# Altium project mb1260.PrjPCB (part 2 of 3)

## Sheet ARDUINO.SchDoc: Arduino UNO connectors
size A4; Author: N.P; CompanyName: STMicroelectronics; Organization: MCD/APPLIS/LMS; DocumentNumber: 12; Revision: D-01; SheetNumber: 12; SheetTotal: 13; Project: STM32F723e-DISCO; BOM Version: D-01
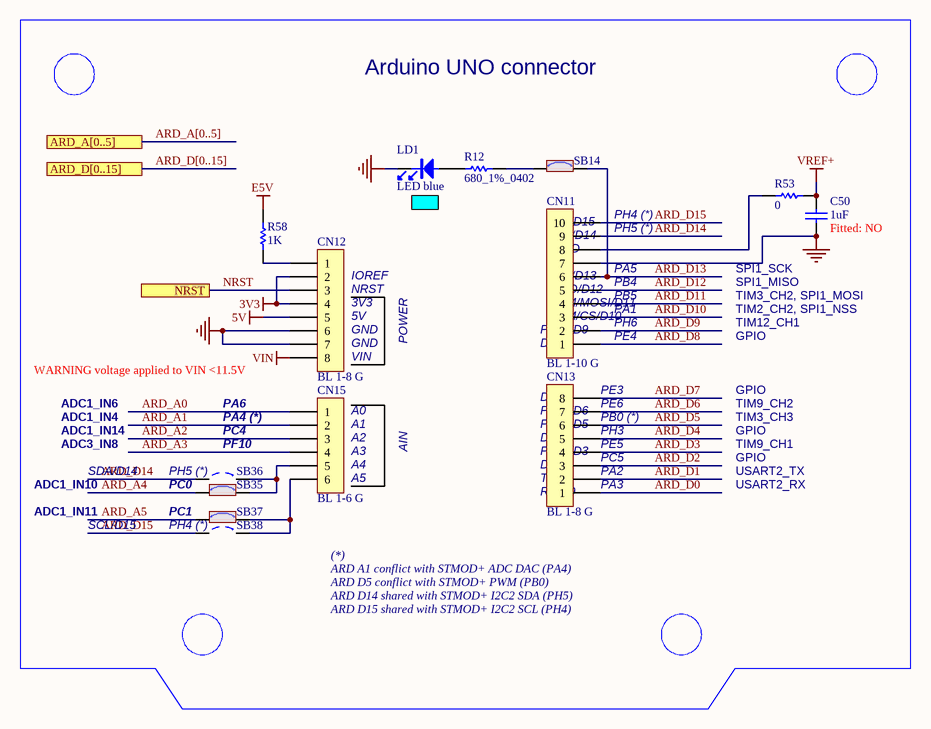
[diagram p5: ARDUINO.SchDoc]

### Parts
C50  1uF  Fitted: NO  [0603C]
CN11  BL 1-10 G  [HDR_1X10_2R54_W]
CN12  BL 1-8 G  [HDR_1X8_2R54_W]
CN13  BL 1-8 G  [HDR_1X8_2R54_W]
CN15  BL 1-6 G  [HDR_1X6_2R54_W]
LD1  LED blue  [0603D]
R12  680_1%_0402  [0402R]
R53  0  [0402R]
R58  1K  [0402R]
SB14  Solder Bridge ON  [JP2_SMD]  (value not drawn)
SB35  Solder Bridge ON  [JP2_SMD]  (value not drawn)
SB36  Solder Bridge OFF  [JP2_SMD]  (value not drawn)
SB37  Solder Bridge ON  [JP2_SMD]  (value not drawn)
SB38  Solder Bridge OFF  [JP2_SMD]  (value not drawn)

### Ports
ARD_A[0..5], ARD_D[0..15], NRST

### Nets
3V3: CN12.2 CN12.4
5V: CN12.5
E5V: R58.2
GND: C50.1 CN11.7 CN12.6 CN12.7 LD1.2
VIN: CN12.8
VREF+: C50.2 R53.2
ARD_A0: CN15.1
ARD_A1: CN15.2
ARD_A2: CN15.3
ARD_A3: CN15.4
ARD_A4: SB35.1
ARD_A5: SB37.1
ARD_D0: CN13.1
ARD_D1: CN13.2
ARD_D2: CN13.3
ARD_D3: CN13.4
ARD_D4: CN13.5
ARD_D5: CN13.6
ARD_D6: CN13.7
ARD_D7: CN13.8
ARD_D8: CN11.1
ARD_D9: CN11.2
ARD_D10: CN11.3
ARD_D11: CN11.4
ARD_D12: CN11.5
ARD_D13: CN11.6 SB14.2
ARD_D14: CN11.9 SB36.1
ARD_D15: CN11.10 SB38.1
NRST: CN12.3 ; port NRST
NetCN11_8: CN11.8 R53.1
NetCN12_1: CN12.1 R58.1
NetCN15_5: CN15.5 SB35.2 SB36.2
NetCN15_6: CN15.6 SB37.2 SB38.2
NetLD1_1: LD1.1 R12.1
NetR12_2: R12.2 SB14.1

### Buses and harness runs
bus ARD_A[0..5] = port ARD_A[0..5]
bus ARD_D[0..15] = port ARD_D[0..15]

### Notes on the sheet
- Arduino UNO connector
- PH4 (*)
- (near CN12) IOREF
- (near CN12) NRST
- (near CN11) SDA/D14
- (near CN11) SCL/D15
- (near CN11) SCK/D13
- (near CN11) MISO/D12
- (near CN11) AVDD
- (near CN11) GND
- (near CN11) PB4
- (near CN11) PA5
- (near CN11) PH5 (*)
- SPI1_MISO
- SPI1_SCK
- (near CN12) 3V3
- (near CN12) 5V
- (near CN12) GND
- POWER
- (near CN11) D8
- (near CN11) PWM/D9
- (near CN11) PWM/CS/D10
- (near CN11) PWM/MOSI/D11
- (near CN11) PA1
- (near CN11) PE4
- (near CN11) PH6
- (near CN11) PB5
- TIM12_CH1
- TIM2_CH2, SPI1_NSS
- TIM3_CH2, SPI1_MOSI
- GPIO
- WARNING voltage applied to VIN <11.5V
- ADC1_IN4
- ADC1_IN6
- PA6
- PA4 (*)
- (near CN15) A0
- (near CN15) A1
- (near CN12) VIN
- (near CN13) PWM/D5
- (near CN13) PWM/D6
- (near CN13) D7
- (near CN13) PE6
- (near CN13) PE3
- (near CN13) PB0 (*)
- TIM3_CH3
- TIM9_CH2
- ADC1_IN10
- ADC3_IN8
- ADC1_IN14
- SDA/D14
- (near SB36) PH5 (*)
- PC0
- PC4
- PF10
- (near CN15) A2
- (near CN15) A3
- (near CN15) A4
- (near CN15) A5
- AIN
- (near CN13) TX/D1
- (near CN13) D2
- (near CN13) D4
- (near CN13) PWM/D3
- (near CN13) PA2
- (near CN13) PC5
- (near CN13) PE5
- (near CN13) PH3
- (near CN13) PA3
- USART2_RX
- USART2_TX
- TIM9_CH1
- ADC1_IN11
- SCL/D15
- PC1
- (near CN13) RX/D0
- (*)
  ARD A1 conflict with STMOD+ ADC DAC (PA4)
  ARD D5 conflict with STMOD+ PWM (PB0)
  ARD D14 shared with STMOD+ I2C2 SDA (PH5)
  ARD D15 shared with STMOD+ I2C2 SCL (PH4)
- Title:
- Project:
- Size:
- Revision:
- Variant:
- -
- Date:
- Reference:
- Sheet:
- of

### Library data of the parts
C50 = Cap_1uF_X5R_10%_0603: Capacitor,1uF,16V,X5R,10%,0603,YAGEO; Manuf_Part_1: CC0603KRX5R7BB105; Ordered by: Subcon; Revision: July-2002: Re-released for DXP Platform.; Value: 1uF; Order: CC0603KRX5R7BB105; Manuf_1: YAGEO; ECCN_US/EU: n/a
CN11 = Header 10X1_Female_THT: Header, 10-Pin, Single row, female, THT, 2.54; Manuf_1: Fischer Electronik; Ordered by: Subcon; Fitted: YES; Manuf_Part_1: BL 1-10 G; Distrib: Sub Co; ECCN_US/EU: n/a
CN12 CN13 = Header 8X1_Female_THT: Header, 8-Pins, Single row, female, THT, 2.54; Manuf_1: Fischer Electronik; Ordered by: Subcon; Fitted: YES; Manuf_Part_1: BL 1-8 G; Distrib: Sub Co; ECCN_US/EU: n/a
CN15 = Header 6X1_Female_THT: Header, 6-Pins, Single row, female THT, 2.54; Manuf_1: Fischer Electronik; Ordered by: Subcon; Fitted: YES; Manuf_Part_1: BL 1-6 G; Distrib: Sub Co; ECCN_US/EU: n/a
LD1 = LED_blue: LED blue 0603; Manuf_1: everlight; Manuf_Part_1: 19-213SUBC/S400-A5/S208-2/S4/TR8; ECCN_US/EU: EAR99/NEC; Fitted: YES; Ordered by: Subcon
R12 = Res_680_1%_0402: Resistor,680,0402,1%,YAGEO; Manuf_Part_1: RC0402FR-07680RL; Manuf_Part_2: RT0402FRE07680RL; Ordered by: Subcon; Fitted: YES; Value: 680; ECCN_US/EU: n/a; Manuf_1: YAGEO; Distrib: FARNELL; Manuf_2: YAGEO
R53 = Res_0_5%_0402: as R35 on sheet AUDIO; Value: 0; ECCN_US/EU: n/a; Manuf_1: YAGEO; Distrib: FARNELL
R58 = Res_1K_1%_0402: Resistor,1K,0402,1%,YAGEO; Manuf_Part_1: RC0402FR-071KL; Ordered by: Subcon; Fitted: YES; Value: 1K; Manuf_1: YAGEO; Order: RC0402FR-071KL; ECCN_US/EU: n/a
SB14 SB35 SB37 = SB_ON: Fitted: YES; Ordered by: Subcon; Revision: July-2002: Re-released for DXP Platform.; ECCN_US/EU: n/a
SB36 SB38 = SB_OFF: Fitted: NO; Ordered by: Subcon; Revision: July-2002: Re-released for DXP Platform.; ECCN_US/EU: n/a

## Sheet PSRAM.SchDoc: PSRAM
size A4; Author: N.P; CompanyName: STMicroelectronics; Organization: MCD/APPLIS/LMS; DocumentNumber: 6; Revision: D-01; SheetNumber: 6; SheetTotal: 13; Project: STM32F723e-DISCO; BOM Version: D-01
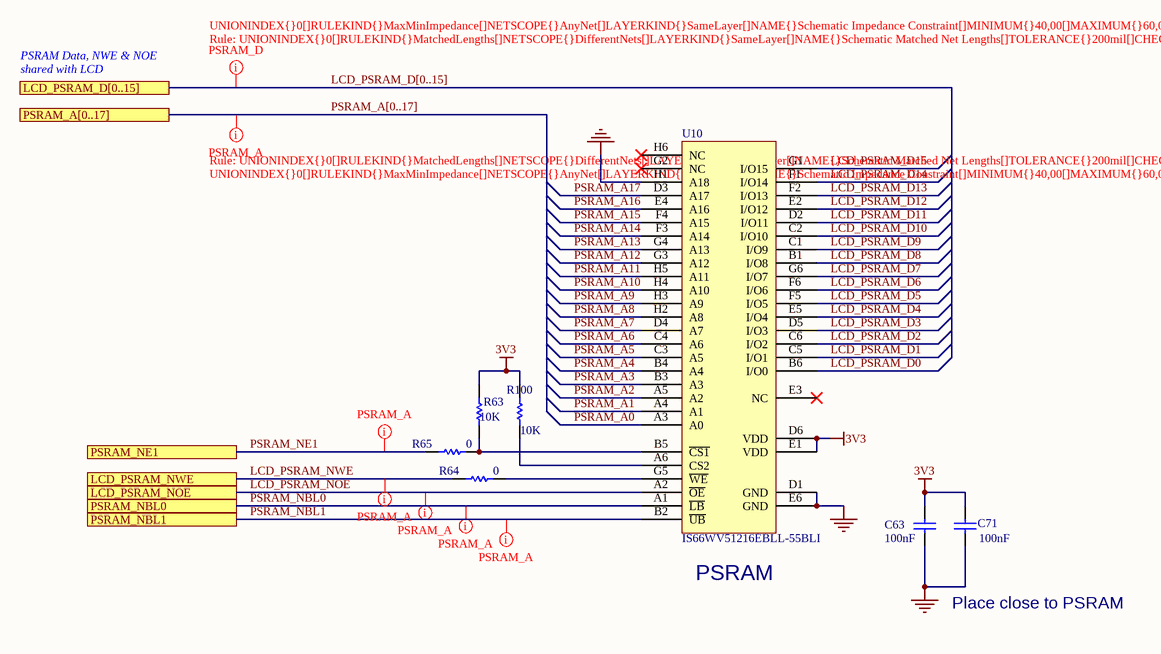
[diagram p6: PSRAM.SchDoc]

### Parts
C63  100nF  [0402C]
C71  100nF  [0402C]
R63  value 10K  [0603R]  (hidden comment: 10K_1%_0603)
R64  value 0  [0603R-GS]  (hidden comment: 0_5%_0603)
R65  value 0  [0603R-GS]  (hidden comment: 0_5%_0603)
R100  value 10K  [0603R]  (hidden comment: 10K_1%_0603)
U10  IS66WV51216EBLL-55BLI  [FBGA48_0R75_6X8]

### Ports
LCD_PSRAM_D[0..15], LCD_PSRAM_NOE, LCD_PSRAM_NWE, PSRAM_A[0..17], PSRAM_NBL0, PSRAM_NBL1, PSRAM_NE1

### Nets
3V3: C63.2 C71.2 R63.2 R100.2 U10.D6(VDD) U10.E1(VDD)
GND: C63.1 C71.1 U10.D1(GND) U10.E6(GND) U10.H1(A18)
LCD_PSRAM_D0: U10.B6(I/O0)
LCD_PSRAM_D1: U10.C5(I/O1)
LCD_PSRAM_D2: U10.C6(I/O2)
LCD_PSRAM_D3: U10.D5(I/O3)
LCD_PSRAM_D4: U10.E5(I/O4)
LCD_PSRAM_D5: U10.F5(I/O5)
LCD_PSRAM_D6: U10.F6(I/O6)
LCD_PSRAM_D7: U10.G6(I/O7)
LCD_PSRAM_D8: U10.B1(I/O8)
LCD_PSRAM_D9: U10.C1(I/O9)
LCD_PSRAM_D10: U10.C2(I/O10)
LCD_PSRAM_D11: U10.D2(I/O11)
LCD_PSRAM_D12: U10.E2(I/O12)
LCD_PSRAM_D13: U10.F2(I/O13)
LCD_PSRAM_D14: U10.F1(I/O14)
LCD_PSRAM_D15: U10.G1(I/O15)
LCD_PSRAM_NOE: U10.A2(~{OE}) ; port LCD_PSRAM_NOE
LCD_PSRAM_NWE: R64.1 ; port LCD_PSRAM_NWE
PSRAM_A0: U10.A3(A0)
PSRAM_A1: U10.A4(A1)
PSRAM_A2: U10.A5(A2)
PSRAM_A3: U10.B3(A3)
PSRAM_A4: U10.B4(A4)
PSRAM_A5: U10.C3(A5)
PSRAM_A6: U10.C4(A6)
PSRAM_A7: U10.D4(A7)
PSRAM_A8: U10.H2(A8)
PSRAM_A9: U10.H3(A9)
PSRAM_A10: U10.H4(A10)
PSRAM_A11: U10.H5(A11)
PSRAM_A12: U10.G3(A12)
PSRAM_A13: U10.G4(A13)
PSRAM_A14: U10.F3(A14)
PSRAM_A15: U10.F4(A15)
PSRAM_A16: U10.E4(A16)
PSRAM_A17: U10.D3(A17)
PSRAM_NBL0: U10.A1(~{LB}) ; port PSRAM_NBL0
PSRAM_NBL1: U10.B2(~{UB}) ; port PSRAM_NBL1
PSRAM_NE1: R65.1 ; port PSRAM_NE1
NetR63_1: R63.1 R65.2 U10.B5(~{CS1})
NetR64_2: R64.2 U10.G5(~{WE})
NetR100_1: R100.1 U10.A6(CS2)

Not connected (* = marked no-connect by the designer): U10 E3(NC)* G2(NC)* H6(NC)*

### Buses and harness runs
bus LCD_PSRAM_D[0..15] = port LCD_PSRAM_D[0..15]
bus PSRAM_A[0..17] = port PSRAM_A[0..17]

### Layout directives
rule Matched Net Lengths [Tolerance = 200mil]; rule Impedance Constraint [Min = 40.00    Max = 60.00    ]: (no net found under the mark), LCD_PSRAM_NOE, LCD_PSRAM_NWE, PSRAM_NBL0, PSRAM_NBL1, PSRAM_NE1

### Notes on the sheet
- PSRAM Data, NWE & NOE shared with LCD
- (near U10) PSRAM
- Place close to PSRAM
- Title:
- Project:
- Size:
- Revision:
- Variant:
- A4
- -
- Date:
- Reference:
- Sheet:
- of

### Library data of the parts
C63 C71 = Cap_100nF_X7R_10%_0402: as C1 on sheet ST_LINK_V2-1; Revision: July-2002: Re-released for DXP Platform.; Value: 100nF; Order: CC0402KRX7R7BB104; Manuf_1: YAGEO; ECCN_US/EU: n/a
R63 R100 = Res_10K_1%_0603: Resistor,10K,0603,1%,YAGEO; Manuf_Part_1: RC0603FR-0710KL; Ordered by: Subcon; Fitted: YES; Manuf_1: YAGEO; Order: RC0603FR-0710KL; ECCN_US/EU: n/a
R64 R65 = Res_0_5%_0603: Resistor,0,0603,5%,YAGEO; Manuf_Part_1: RC0603JR-070RL; Order: 2363481; Ordered by: Subcon; Fitted: YES; ECCN_US/EU: n/a; Manuf_1: YAGEO; Distrib: FARNELL
U10 = IS66WV51216EBLL-55BLI: IC SRAM 8MBIT 55NS 48MINIBGA 6mm x 8mm; Manuf_1: ISSI, Integrated Silicon Solution Inc; Fitted: YES; Ordered_By: Subcon; Manuf_Part_1: IS66WV51216EBLL-55BLI; Value: IS66WV51216EBLL-55BLI; ECCN_US/EU: n/a; Distrib: *; Order_Code: *; Ordered by: Subcon

## Sheet USB_OTG_FS.SchDoc: USB OTG FS
size A4; Author: N.P; CompanyName: STMicroelectronics; Organization: MCD/APPLIS/LMS; DocumentNumber: 9; Revision: D-01; SheetNumber: 9; SheetTotal: 13; Project: STM32F723e-DISCO; BOM Version: D-01
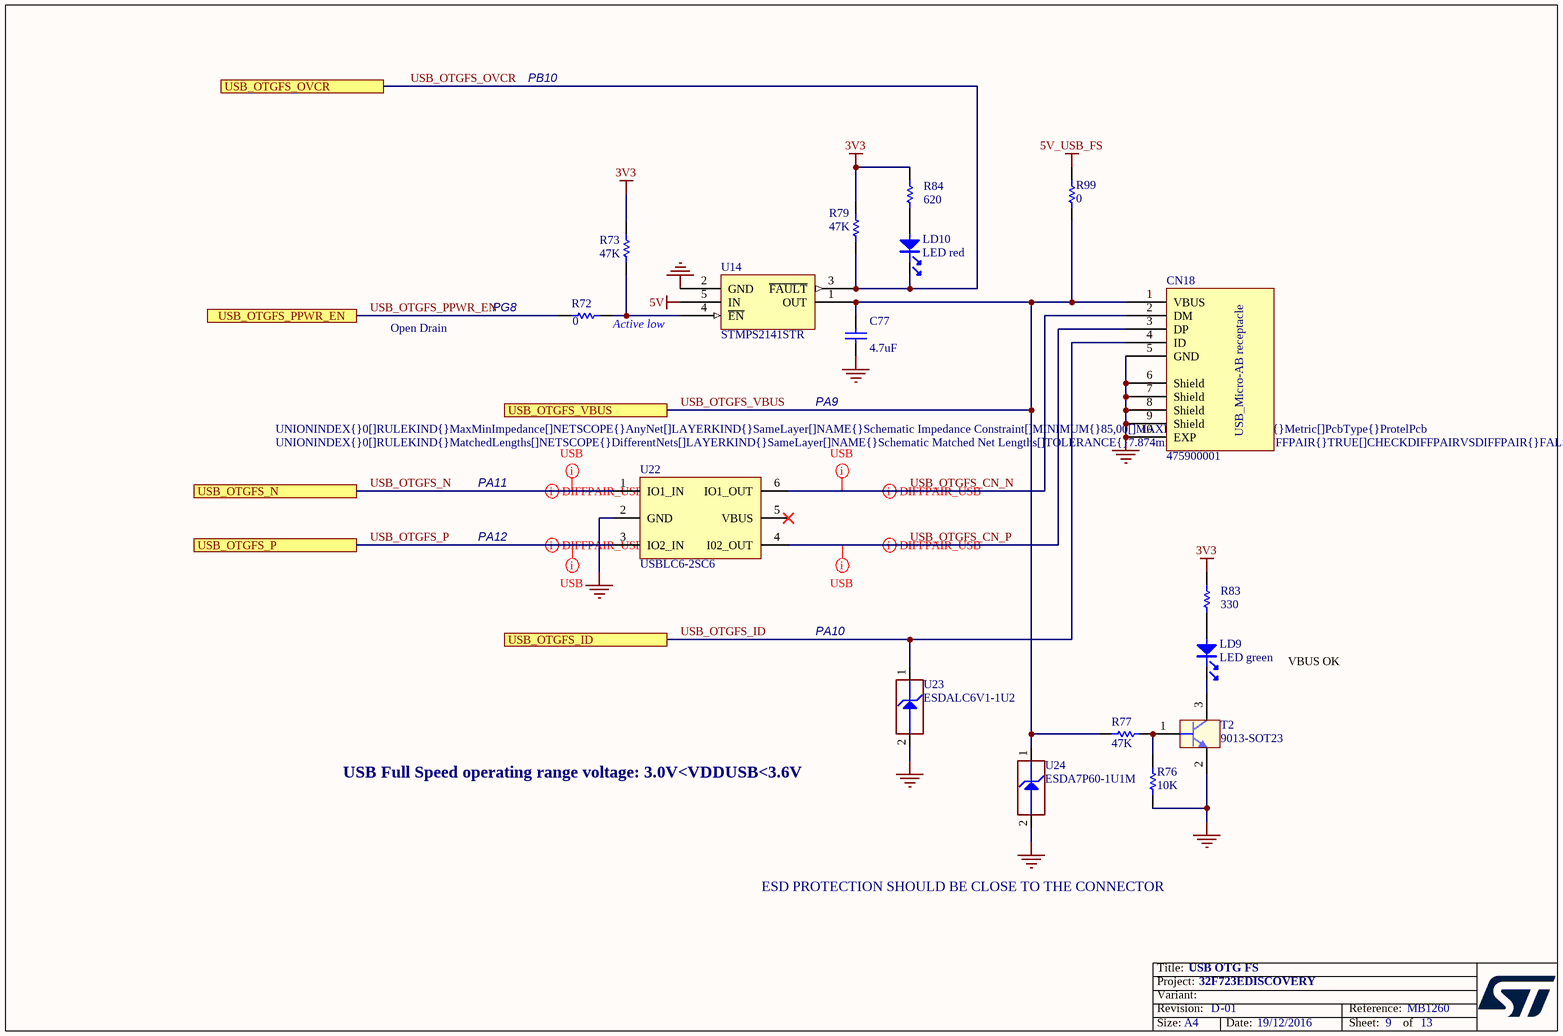
[diagram p7: USB_OTG_FS.SchDoc]

### Parts
C77  4.7uF  [0603C]
CN18  475900001  [MOLEX_47590001]
LD9  LED green  [0603D]
LD10  LED red  [0603D]
R72  value 0  [0603R-GS]  (hidden comment: 0_5%_0603)
R73  value 47K  [0402R]  (hidden comment: 47K_1%_0402)
R76  10K  [0402R]
R77  value 47K  [0402R]  (hidden comment: 47K_1%_0402)
R79  value 47K  [0402R]  (hidden comment: 47K_1%_0402)
R83  value 330  [0603R]  (hidden comment: 330_1%_0603)
R84  value 620  [0603R]  (hidden comment: 620_1%_0603)
R99  value 0  [0603R-GS]  (hidden comment: 0_5%_0603)
T2  9013-SOT23  [SOT-23]
U14  STMPS2141STR  [SOT23-5]
U22  USBLC6-2SC6  [SOT23-6]
U23  ESDALC6V1-1U2  [ESD_ST0201]
U24  ESDA7P60-1U1M  [ESD_ST0201]

### Ports
USB_OTGFS_ID, USB_OTGFS_N, USB_OTGFS_OVCR, USB_OTGFS_P, USB_OTGFS_PPWR_EN, USB_OTGFS_VBUS

### Nets
3V3: R73.2 R79.2 R83.2 R84.2
5V: U14.5(IN)
5V_USB_FS: R99.2
GND: C77.2 CN18.5(GND) CN18.6(Shield) CN18.7(Shield) CN18.8(Shield) CN18.9(Shield) CN18.10(EXP) R76.1 T2.2(E) U14.2(GND) U22.2(GND) U23.2(GND) U24.2(GND)
USB_OTGFS_CN_N: CN18.2(DM) U22.6(IO1_OUT)
USB_OTGFS_CN_P: CN18.3(DP) U22.4(I02_OUT)
USB_OTGFS_ID: CN18.4(ID) U23.1(IO1) ; port USB_OTGFS_ID
USB_OTGFS_N: U22.1(IO1_IN) ; port USB_OTGFS_N
USB_OTGFS_OVCR: LD10.2 R79.1 U14.3(~{FAULT}) ; port USB_OTGFS_OVCR
USB_OTGFS_P: U22.3(IO2_IN) ; port USB_OTGFS_P
USB_OTGFS_PPWR_EN: R72.1 ; port USB_OTGFS_PPWR_EN
USB_OTGFS_VBUS: C77.1 CN18.1(VBUS) R77.2 R99.1 U14.1(OUT) U24.1(IO1) ; port USB_OTGFS_VBUS
NetLD9_1: LD9.1 R83.1
NetLD9_2: LD9.2 T2.3(C)
NetLD10_1: LD10.1 R84.1
NetR72_2: R72.2 R73.1 U14.4(~{EN})
NetR76_2: R76.2 R77.1 T2.1(B)

Not connected (* = marked no-connect by the designer): U22 5(VBUS)*

### Layout directives
rule Undefined; rule Matched Net Lengths [Tolerance = 0.2mm]; rule Impedance Constraint [Min = 85.00    Max = 95.00    ]: USB_OTGFS_CN_N, USB_OTGFS_CN_P, USB_OTGFS_N, USB_OTGFS_P
differential pair; rule Impedance Constraint [Min = 85.00    Max = 95.00    ]: USB_OTGFS_CN_N, USB_OTGFS_CN_P, USB_OTGFS_N, USB_OTGFS_P

### Notes on the sheet
- PB10
- (near R72) PG8
- Open Drain
- (near R72) Active low
- PA9
- PA11
- PA12
- PA10
- VBUS OK
- USB Full Speed operating range voltage: 3.0V<VDDUSB<3.6V
- ESD PROTECTION SHOULD BE CLOSE TO THE CONNECTOR
- Title:
- Project:
- Size:
- Revision:
- Variant:
- A4
- -
- Date:
- Reference:
- Sheet:
- of
- (in symbol 475900001) USB_Micro-AB receptacle

### Library data of the parts
C77 = Cap_4.7uF_X5R_10%_0603: Capacitor,4.7uF,16V, X5R,10%,0603,YAGEO; Manuf_Part_1: CC0603KRX5R7BB475; Order: CC0603KRX5R7BB105; Ordered by: Subcon; Fitted: YES; Revision: July-2002: Re-released for DXP Platform.; Value: 4.7uF; Manuf_1: YAGEO; ECCN_US/EU: n/a
CN18 = 475900001: USB-MICRO-AB, 47590-0001, SMT, MOLEX; Ordered by: Subcon; Fitted: YES; Manuf_Part_1: 47590-0001; Manuf_1: MOLEX; ECCN_US/EU: n/a
LD9 = LED_green: LED green 0603; Manuf_1: everlight; Manuf_Part_1: 19-213SYGC/S530-E2/TR8; Ordered by: Subcon; Fitted: YES; Order: 19-213SYGC/S530-E2/TR8; ECCN_US/EU: n/a
LD10 = LED_red: LED red 0603; Manuf_1: everlight; Manuf_Part_1: 19-213-R6C-AP1Q2B/3T; Ordered by: Subcon; Fitted: YES; Order: 19-213-R6C-AP1Q2B/3T; ECCN_US/EU: n/a
R72 R99 = Res_0_5%_0603: Resistor,0,0603,5%,YAGEO; Manuf_Part_1: RC0603JR-070RL; Order: 2363481; Ordered by: Subcon; Fitted: YES; ECCN_US/EU: n/a; Manuf_1: YAGEO; Distrib: FARNELL
R73 R77 R79 = Res_47K_1%_0402: Resistor,47K,0402,1%,YAGEO; Manuf_Part_1: RC0402FR-0747KL; Order: 9239430; Ordered by: Subcon; Fitted: YES; Manuf_1: YAGEO; ECCN_US/EU: n/a; Distrib: FARNELL
R76 = Res_10K_1%_0402: Resistor,10K,0402,1%,YAGEO; Manuf_Part_1: RC0402FR-0710KL; Ordered by: Subcon; Fitted: YES; Value: 10K; Manuf_1: YAGEO; Order: RC0402FR-0710KL; ECCN_US/EU: n/a
R83 = Res_330_1%_0603: Resistor,330,0603,1%,YAGEO; Manuf_Part_1: RC0603FR-07330RL; Manuf_Part_2: RT0603FRE07330RL; Ordered by: Subcon; Fitted: YES; ECCN_US/EU: n/a; Manuf_1: YAGEO; Distrib: FARNELL; Manuf_2: YAGEO
R84 = Res_620_1%_0603: Resistor,620,0603,1%,VISHAY; Manuf_Part_1: CRCW0603620RFKEA; Manuf_1: VISHAY DRALORIC; Order: 2122341; Ordered by: Subcon; Fitted: YES; ECCN_US/EU: n/a; Distrib: FARNELL
T2 = 9013-SOT23: NPN Bipolar Transistor; Manuf_1: NXP; Manuf_Part_1: BSR14; Order: 1081310; Ordered by: Subcon; Fitted: YES; Revision: July-2002: Re-released for DXP Platform.; Distrib: FARNELL; ECCN_US/EU: n/a
U14 = STMPS2141STR: Enhanced single channel power switches; Manuf_1: STM; Provided: ST; ECCN_US/EU: EAR99/NEC; Ref St: 9159003; Fitted: YES; Order: STMPS2141STR; Manuf_Part_1: STMPS2141STR; Distrib: ST; Ordered by: ST
U22 = USBLC6-2SC6: Very low capacitance ESD protection; Manuf_1: STM; Provided: ST; ECCN_US/EU: EAR99/NEC; Fitted: YES; Manuf_Part_1: USBLC6-2SC6; Distrib: ST; Ordered by: ST
U23 = ESDALC6V1-1U2: Dual Transil array for ESD protection; Manuf_1: STM; Ref St: .; ECCN_US/EU: EAR99/NEC; Fitted: YES; Provided: ST; Manuf_Part_1: ESDALC6V1-1U2; Distrib: ST; Ordered_By: STM; Order: ESDALC6V1-1U2
U24 = MCD-00251: High power transient voltage suppressor, 7V breakdown; Manuf_1: STM; ECCN_US/EU: EAR99/NEC; Fitted: YES; Manuf_Part_1: ESDA7P60-1U1M; Ordered_By: STM; Value: ESDA7P60-1U1M; Internal_Part_Number: MCD-00251; PartType: ICS; Manufacturer_Part_Number_1: ESDA7P60-1U1M; Manufacturer_1: STM; ComponentLink1URL: ST_ESDA7P60-1U1M.pdf; Provided_By: STM

## Sheet STM32F7.SchDoc: STM32F723e Connexion
size A3; Author: N.P; CompanyName: STMicroelectronics; Organization: MCD/APPLIS/LMS; DocumentNumber: 4; Revision: D-01; SheetNumber: 4; SheetTotal: 13; Project: STM32F723e-DISCO; BOM Version: D-01
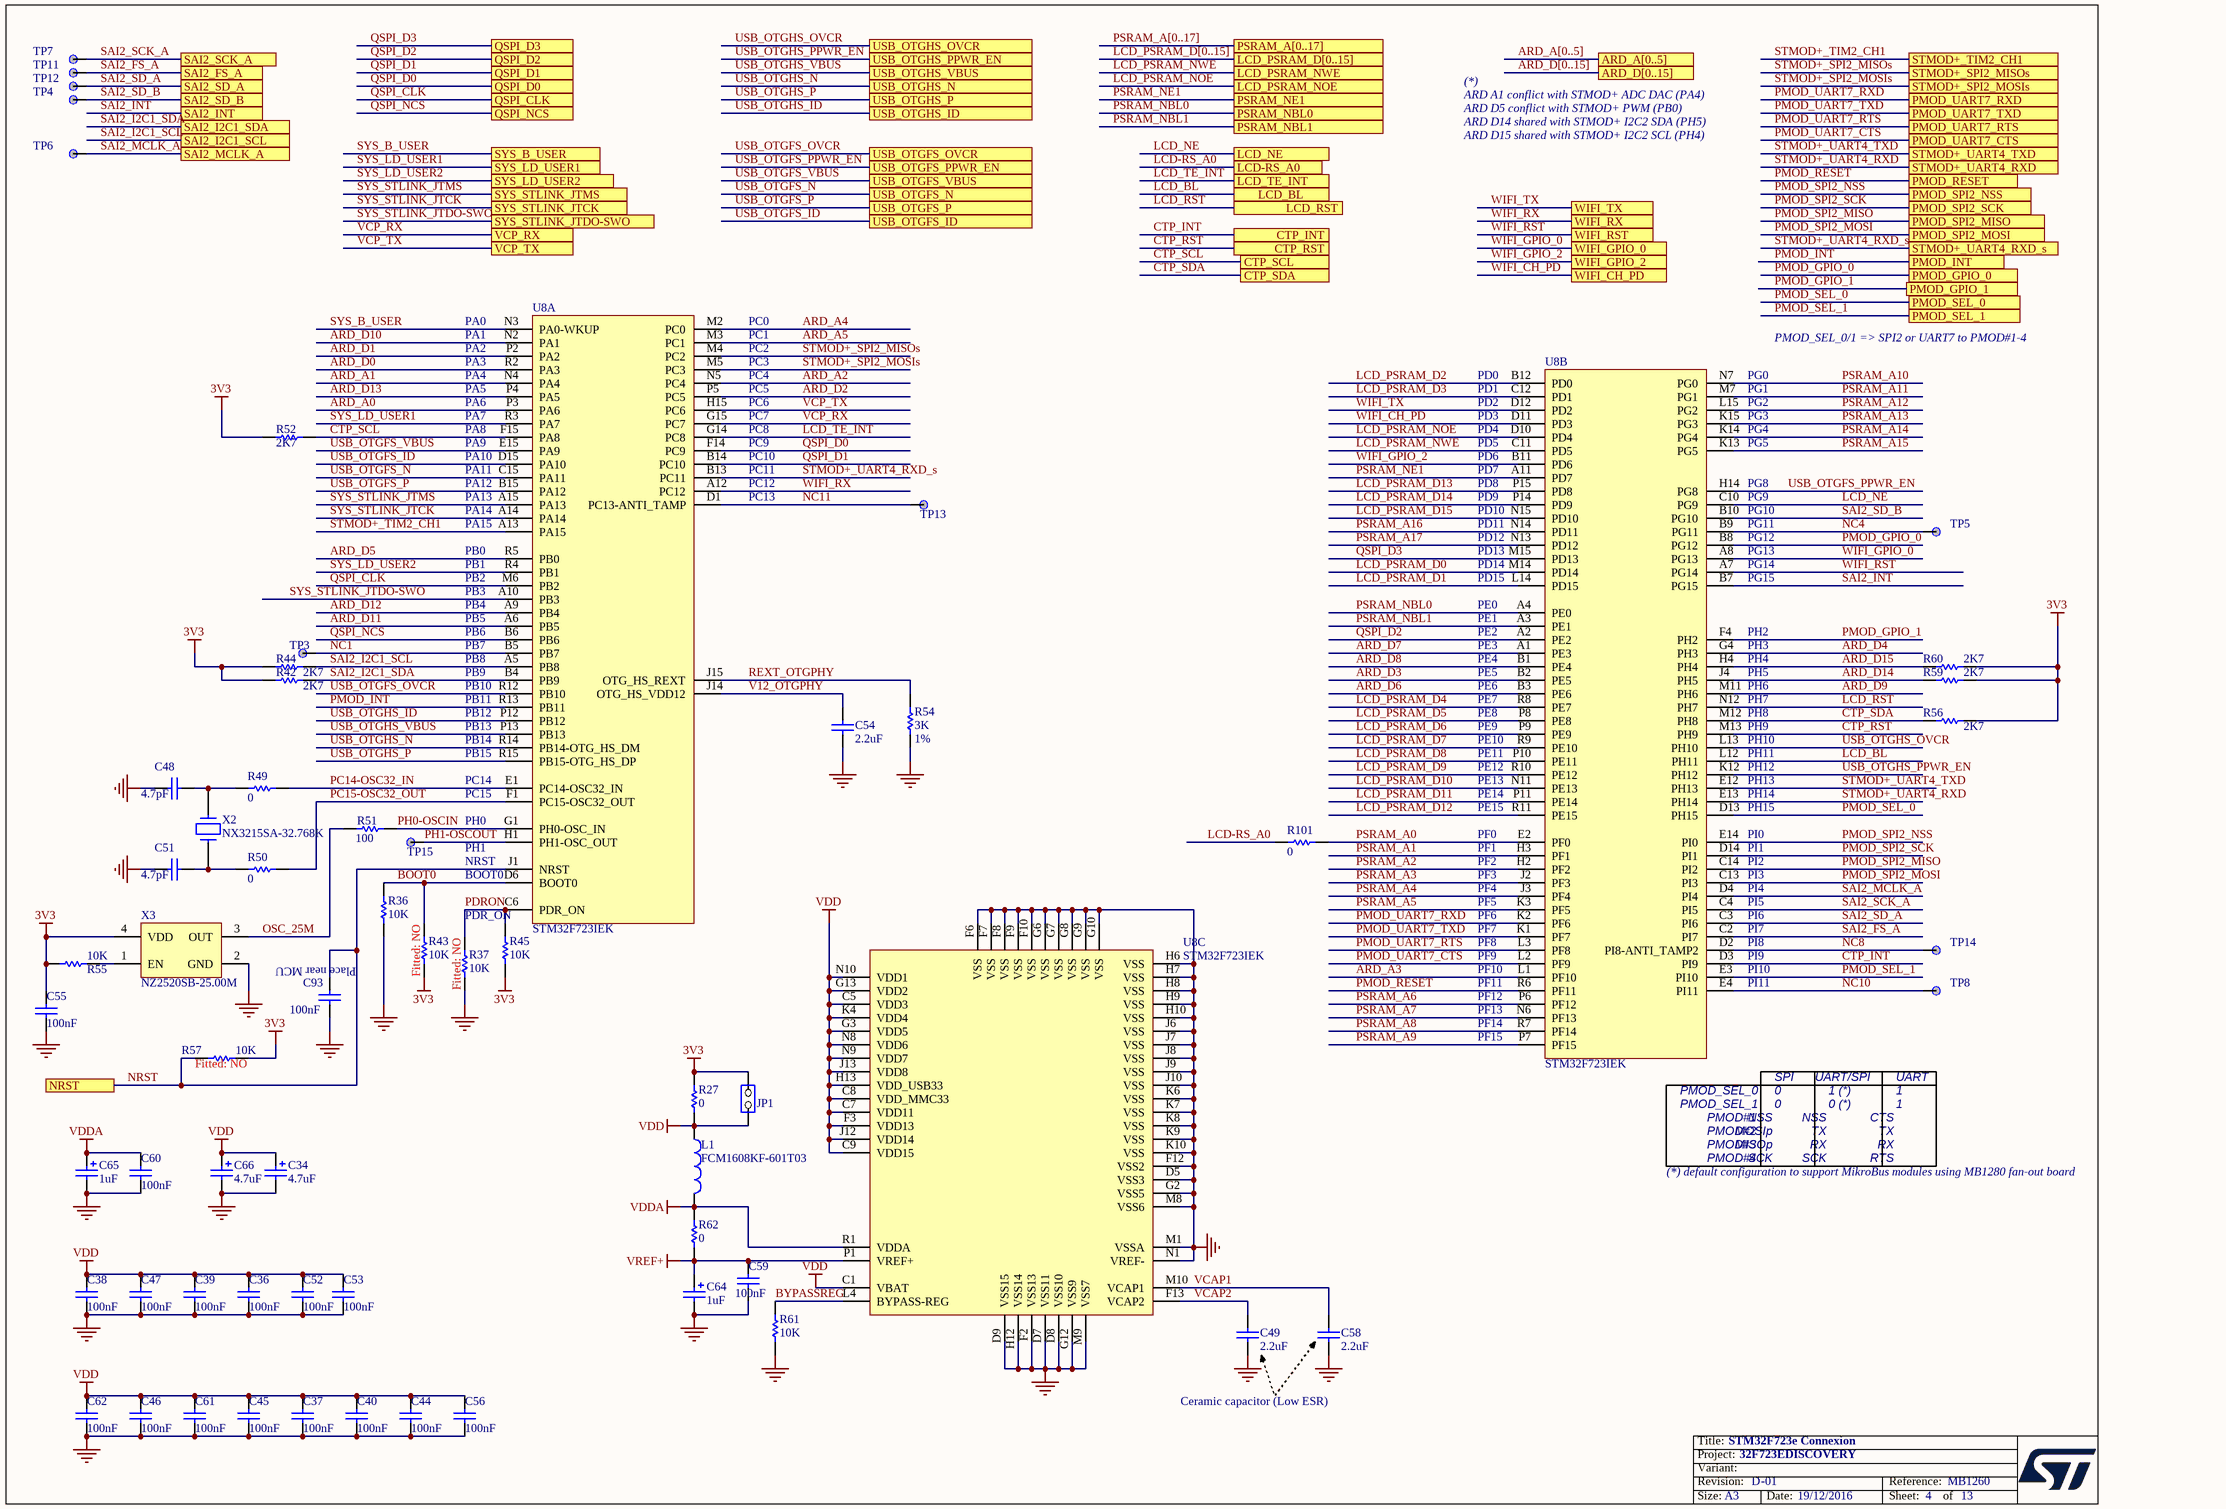
[diagram p8: STM32F7.SchDoc]

### Parts
C34  4.7uF  [TAN-A]
C36  100nF  [0402C]
C37  100nF  [0402C]
C38  100nF  [0402C]
C39  100nF  [0402C]
C40  100nF  [0402C]
C44  100nF  [0402C]
C45  100nF  [0402C]
C46  100nF  [0402C]
C47  100nF  [0402C]
C48  value 4.7pF  [0402C]  (hidden comment: 4.7pF_NPO_-+0.25pF_0402)
C49  2.2uF  [1206C]
C51  value 4.7pF  [0402C]  (hidden comment: 4.7pF_NPO_-+0.25pF_0402)
C52  100nF  [0402C]
C53  100nF  [0402C]
C54  value 2.2uF  [0603C]  (hidden comment: 2.2uF_X5R_10%_0603)
C55  100nF  [0402C]
C56  100nF  [0402C]
C58  2.2uF  [1206C]
C59  100nF  [0402C]
C60  100nF  [0402C]
C61  100nF  [0402C]
C62  100nF  [0402C]
C64  1uF  [TAN-A]
C65  1uF  [TAN-A]
C66  4.7uF  [TAN-A]
C93  100nF  [0402C]
JP1  JP2  [SIP2]  (value not drawn)
L1  FCM1608KF-601T03  [0603L]
R27  value 0  [0603R-GS]  (hidden comment: 0_5%_0603)
R36  10K  [0402R]
R37  Fitted: NO  [0402R]  (hidden comment: 10K)
R42  2K7  [0402R]
R43  Fitted: NO  [0402R]  (hidden comment: 10K)
R44  2K7  [0402R]
R45  10K  [0402R]
R49  0  [0402R]
R50  0  [0402R]
R51  100  [0402R]
R52  2K7  [0402R]
R54  3K  Tolerance: 1%  [0402R]
R55  10K  [0402R]
R56  2K7  [0402R]
R57  Fitted: NO  [0402R]  (hidden comment: 10K)
R59  2K7  [0402R]
R60  2K7  [0402R]
R61  10K  [0402R]
R62  value 0  [0603R-GS]  (hidden comment: 0_5%_0603)
R101  0  [0402R]
TP3  TP  [TP_C40]  (value not drawn)
TP4  TP  [TP_C40]  (value not drawn)
TP5  TP  [TP_C40]  (value not drawn)
TP6  TP  [TP_C40]  (value not drawn)
TP7  TP  [TP_C40]  (value not drawn)
TP8  TP  [TP_C40]  (value not drawn)
TP11  TP  [TP_C40]  (value not drawn)
TP12  TP  [TP_C40]  (value not drawn)
TP13  TP  [TP_C40]  (value not drawn)
TP14  TP  [TP_C40]  (value not drawn)
TP15  TP  [TP_C40]  (value not drawn)
U8  STM32F723IEK  [BGA176_0R65_10x10]  (parts A,B,C of 3)
X2  NX3215SA-32.768K  [XTAL_2SM_3R2X1R5]
X3  NZ2520SB-25.00M  [OSC_4SM_2R5X2]

### Ports
ARD_A[0..5], ARD_D[0..15], CTP_INT, CTP_RST, CTP_SCL, CTP_SDA, LCD-RS_A0, LCD_BL, LCD_NE, LCD_PSRAM_D[0..15], LCD_PSRAM_NOE, LCD_PSRAM_NWE, LCD_RST, LCD_TE_INT, NRST, PMOD_GPIO_0, PMOD_GPIO_1, PMOD_INT, PMOD_RESET, PMOD_SEL_0, PMOD_SEL_1, PMOD_SPI2_MISO, PMOD_SPI2_MOSI, PMOD_SPI2_NSS, PMOD_SPI2_SCK, PMOD_UART7_CTS, PMOD_UART7_RTS, PMOD_UART7_RXD, PMOD_UART7_TXD, PSRAM_A[0..17], PSRAM_NBL0, PSRAM_NBL1, PSRAM_NE1, QSPI_CLK, QSPI_D0, QSPI_D1, QSPI_D2, QSPI_D3, QSPI_NCS, SAI2_FS_A, SAI2_I2C1_SCL, SAI2_I2C1_SDA, SAI2_INT, SAI2_MCLK_A, SAI2_SCK_A, SAI2_SD_A, SAI2_SD_B, STMOD+_SPI2_MISOs, STMOD+_SPI2_MOSIs, STMOD+_TIM2_CH1, STMOD+_UART4_RXD, STMOD+_UART4_RXD_s, STMOD+_UART4_TXD, SYS_B_USER, SYS_LD_USER1, SYS_LD_USER2, SYS_STLINK_JTCK, SYS_STLINK_JTDO-SWO, SYS_STLINK_JTMS, USB_OTGFS_ID, USB_OTGFS_N, USB_OTGFS_OVCR, USB_OTGFS_P, USB_OTGFS_PPWR_EN, USB_OTGFS_VBUS, USB_OTGHS_ID, USB_OTGHS_N, USB_OTGHS_OVCR, USB_OTGHS_P, USB_OTGHS_PPWR_EN, USB_OTGHS_VBUS, VCP_RX, VCP_TX, WIFI_CH_PD, WIFI_GPIO_0, WIFI_GPIO_2, WIFI_RST, WIFI_RX, WIFI_TX

### Nets
3V3: C55.2 JP1.2(NO) R27.2 R42.1 R43.1 R44.1 R45.1 R52.1 R55.1 R56.2 R57.2 R59.2 R60.2 X3.4(VDD)
GND: C34.2 C36.1 C37.1 C38.1 C39.1 C40.1 C44.1 C45.1 C46.1 C47.1 C48.1 C49.1 C51.1 C52.1 C53.1 C54.1 C55.1 C56.1 C58.1 C59.1 C60.1 C61.1 C62.1 C64.2 C65.2 C66.2 C93.1 R36.1 R37.1 R54.1 R61.1 U8.D5(VSS3) U8.D7(VSS11) U8.D8(VSS10) U8.D9(VSS15) U8.F2(VSS13) U8.F6(VSS) U8.F7(VSS) U8.F8(VSS) U8.F9(VSS) U8.F10(VSS) U8.F12(VSS2) U8.G2(VSS5) U8.G6(VSS) U8.G7(VSS) U8.G8(VSS) U8.G9(VSS) U8.G10(VSS) U8.G12(VSS9) U8.H6(VSS) U8.H7(VSS) U8.H8(VSS) U8.H9(VSS) U8.H10(VSS) U8.H12(VSS14) U8.J6(VSS) U8.J7(VSS) U8.J8(VSS) U8.J9(VSS) U8.J10(VSS) U8.K6(VSS) U8.K7(VSS) U8.K8(VSS) U8.K9(VSS) U8.K10(VSS) U8.M1(VSSA) U8.M8(VSS6) U8.M9(VSS7) U8.N1(VREF-) X3.2(GND)
VDD: C34.1 C36.2 C37.2 C38.2 C39.2 C40.2 C44.2 C45.2 C46.2 C47.2 C52.2 C53.2 C56.2 C61.2 C62.2 C66.1 JP1.1(COMMON) L1.1 R27.1 U8.C1(VBAT) U8.C5(VDD3) U8.C7(VDD11) U8.C8(VDD_MMC33) U8.C9(VDD15) U8.F3(VDD13) U8.G3(VDD5) U8.G13(VDD2) U8.H13(VDD_USB33) U8.J12(VDD14) U8.J13(VDD8) U8.K4(VDD4) U8.N8(VDD6) U8.N9(VDD7) U8.N10(VDD1)
VDDA: C60.2 C65.1 L1.2 R62.2 U8.R1(VDDA)
VREF+: C59.2 C64.1 R62.1 U8.P1(VREF+)
ARD_A0: U8.P3(PA6)
ARD_A1: U8.N4(PA4)
ARD_A2: U8.N5(PC4)
ARD_A3: U8.L1(PF10)
ARD_A4: U8.M2(PC0)
ARD_A5: U8.M3(PC1)
ARD_D0: U8.R2(PA3)
ARD_D1: U8.P2(PA2)
ARD_D2: U8.P5(PC5)
ARD_D3: U8.B2(PE5)
ARD_D4: U8.G4(PH3)
ARD_D5: U8.R5(PB0)
ARD_D6: U8.B3(PE6)
ARD_D7: U8.A1(PE3)
ARD_D8: U8.B1(PE4)
ARD_D9: U8.M11(PH6)
ARD_D10: U8.N2(PA1)
ARD_D11: U8.A6(PB5)
ARD_D12: U8.A9(PB4)
ARD_D13: U8.P4(PA5)
ARD_D14: R59.1 U8.J4(PH5)
ARD_D15: R60.1 U8.H4(PH4)
BOOT0: R36.2 R43.2 U8.D6(BOOT0)
BYPASSREG: R61.2 U8.L4(BYPASS-REG)
CTP_INT: U8.D3(PI9) ; port CTP_INT
CTP_RST: U8.M13(PH9) ; port CTP_RST
CTP_SCL: R52.2 U8.F15(PA8) ; port CTP_SCL
CTP_SDA: R56.1 U8.M12(PH8) ; port CTP_SDA
LCD-RS_A0: R101.2 ; port LCD-RS_A0
LCD_BL: U8.L12(PH11) ; port LCD_BL
LCD_NE: U8.C10(PG9) ; port LCD_NE
LCD_PSRAM_D0: U8.M14(PD14)
LCD_PSRAM_D1: U8.L14(PD15)
LCD_PSRAM_D2: U8.B12(PD0)
LCD_PSRAM_D3: U8.C12(PD1)
LCD_PSRAM_D4: U8.R8(PE7)
LCD_PSRAM_D5: U8.P8(PE8)
LCD_PSRAM_D6: U8.P9(PE9)
LCD_PSRAM_D7: U8.R9(PE10)
LCD_PSRAM_D8: U8.P10(PE11)
LCD_PSRAM_D9: U8.R10(PE12)
LCD_PSRAM_D10: U8.N11(PE13)
LCD_PSRAM_D11: U8.P11(PE14)
LCD_PSRAM_D12: U8.R11(PE15)
LCD_PSRAM_D13: U8.P15(PD8)
LCD_PSRAM_D14: U8.P14(PD9)
LCD_PSRAM_D15: U8.N15(PD10)
LCD_PSRAM_NOE: U8.D10(PD4) ; port LCD_PSRAM_NOE
LCD_PSRAM_NWE: U8.C11(PD5) ; port LCD_PSRAM_NWE
LCD_RST: U8.N12(PH7) ; port LCD_RST
LCD_TE_INT: U8.G14(PC8) ; port LCD_TE_INT
NC1: TP3.1 U8.B5(PB7)
NC4: TP5.1 U8.B9(PG11)
NC8: TP14.1 U8.D2(PI8-ANTI_TAMP2)
NC10: TP8.1 U8.E4(PI11)
NC11: TP13.1 U8.D1(PC13-ANTI_TAMP)
NRST: C93.2 R57.1 U8.J1(NRST) ; port NRST
OSC_25M: R51.1 X3.3(OUT)
PC14-OSC32_IN: R49.2 U8.E1(PC14-OSC32_IN)
PC15-OSC32_OUT: R50.2 U8.F1(PC15-OSC32_OUT)
PDRON: R37.2 R45.2 U8.C6(PDR_ON)
PH0-OSCIN: R51.2 U8.G1(PH0-OSC_IN)
PH1-OSCOUT: TP15.1 U8.H1(PH1-OSC_OUT)
PMOD_GPIO_0: U8.B8(PG12) ; port PMOD_GPIO_0
PMOD_GPIO_1: U8.F4(PH2) ; port PMOD_GPIO_1
PMOD_INT: U8.R13(PB11) ; port PMOD_INT
PMOD_RESET: U8.R6(PF11) ; port PMOD_RESET
PMOD_SEL_0: U8.D13(PH15) ; port PMOD_SEL_0
PMOD_SEL_1: U8.E3(PI10) ; port PMOD_SEL_1
PMOD_SPI2_MISO: U8.C14(PI2) ; port PMOD_SPI2_MISO
PMOD_SPI2_MOSI: U8.C13(PI3) ; port PMOD_SPI2_MOSI
PMOD_SPI2_NSS: U8.E14(PI0) ; port PMOD_SPI2_NSS
PMOD_SPI2_SCK: U8.D14(PI1) ; port PMOD_SPI2_SCK
PMOD_UART7_CTS: U8.L2(PF9) ; port PMOD_UART7_CTS
PMOD_UART7_RTS: U8.L3(PF8) ; port PMOD_UART7_RTS
PMOD_UART7_RXD: U8.K2(PF6) ; port PMOD_UART7_RXD
PMOD_UART7_TXD: U8.K1(PF7) ; port PMOD_UART7_TXD
PSRAM_A0: R101.1 U8.E2(PF0)
PSRAM_A1: U8.H3(PF1)
PSRAM_A2: U8.H2(PF2)
PSRAM_A3: U8.J2(PF3)
PSRAM_A4: U8.J3(PF4)
PSRAM_A5: U8.K3(PF5)
PSRAM_A6: U8.P6(PF12)
PSRAM_A7: U8.N6(PF13)
PSRAM_A8: U8.R7(PF14)
PSRAM_A9: U8.P7(PF15)
PSRAM_A10: U8.N7(PG0)
PSRAM_A11: U8.M7(PG1)
PSRAM_A12: U8.L15(PG2)
PSRAM_A13: U8.K15(PG3)
PSRAM_A14: U8.K14(PG4)
PSRAM_A15: U8.K13(PG5)
PSRAM_A16: U8.N14(PD11)
PSRAM_A17: U8.N13(PD12)
PSRAM_NBL0: U8.A4(PE0) ; port PSRAM_NBL0
PSRAM_NBL1: U8.A3(PE1) ; port PSRAM_NBL1
PSRAM_NE1: U8.A11(PD7) ; port PSRAM_NE1
QSPI_CLK: U8.M6(PB2) ; port QSPI_CLK
QSPI_D0: U8.F14(PC9) ; port QSPI_D0
QSPI_D1: U8.B14(PC10) ; port QSPI_D1
QSPI_D2: U8.A2(PE2) ; port QSPI_D2
QSPI_D3: U8.M15(PD13) ; port QSPI_D3
QSPI_NCS: U8.B6(PB6) ; port QSPI_NCS
REXT_OTGPHY: R54.2 U8.J15(OTG_HS_REXT)
SAI2_FS_A: TP11.1 U8.C2(PI7) ; port SAI2_FS_A
SAI2_I2C1_SCL: R44.2 U8.A5(PB8) ; port SAI2_I2C1_SCL
SAI2_I2C1_SDA: R42.2 U8.B4(PB9) ; port SAI2_I2C1_SDA
SAI2_INT: U8.B7(PG15) ; port SAI2_INT
SAI2_MCLK_A: TP6.1 U8.D4(PI4) ; port SAI2_MCLK_A
SAI2_SCK_A: TP7.1 U8.C4(PI5) ; port SAI2_SCK_A
SAI2_SD_A: TP12.1 U8.C3(PI6) ; port SAI2_SD_A
SAI2_SD_B: TP4.1 U8.B10(PG10) ; port SAI2_SD_B
STMOD+_SPI2_MISOs: U8.M4(PC2) ; port STMOD+_SPI2_MISOs
STMOD+_SPI2_MOSIs: U8.M5(PC3) ; port STMOD+_SPI2_MOSIs
STMOD+_TIM2_CH1: U8.A13(PA15) ; port STMOD+_TIM2_CH1
STMOD+_UART4_RXD: U8.E13(PH14) ; port STMOD+_UART4_RXD
STMOD+_UART4_RXD_s: U8.B13(PC11) ; port STMOD+_UART4_RXD_s
STMOD+_UART4_TXD: U8.E12(PH13) ; port STMOD+_UART4_TXD
SYS_B_USER: U8.N3(PA0-WKUP) ; port SYS_B_USER
SYS_LD_USER1: U8.R3(PA7) ; port SYS_LD_USER1
SYS_LD_USER2: U8.R4(PB1) ; port SYS_LD_USER2
SYS_STLINK_JTCK: U8.A14(PA14) ; port SYS_STLINK_JTCK
SYS_STLINK_JTDO-SWO: U8.A10(PB3) ; port SYS_STLINK_JTDO-SWO
SYS_STLINK_JTMS: U8.A15(PA13) ; port SYS_STLINK_JTMS
USB_OTGFS_ID: U8.D15(PA10) ; port USB_OTGFS_ID
USB_OTGFS_N: U8.C15(PA11) ; port USB_OTGFS_N
USB_OTGFS_OVCR: U8.R12(PB10) ; port USB_OTGFS_OVCR
USB_OTGFS_P: U8.B15(PA12) ; port USB_OTGFS_P
USB_OTGFS_PPWR_EN: U8.H14(PG8) ; port USB_OTGFS_PPWR_EN
USB_OTGFS_VBUS: U8.E15(PA9) ; port USB_OTGFS_VBUS
USB_OTGHS_ID: U8.P12(PB12) ; port USB_OTGHS_ID
USB_OTGHS_N: U8.R14(PB14-OTG_HS_DM) ; port USB_OTGHS_N
USB_OTGHS_OVCR: U8.L13(PH10) ; port USB_OTGHS_OVCR
USB_OTGHS_P: U8.R15(PB15-OTG_HS_DP) ; port USB_OTGHS_P
USB_OTGHS_PPWR_EN: U8.K12(PH12) ; port USB_OTGHS_PPWR_EN
USB_OTGHS_VBUS: U8.P13(PB13) ; port USB_OTGHS_VBUS
V12_OTGPHY: C54.2 U8.J14(OTG_HS_VDD12)
VCAP1: C58.2 U8.M10(VCAP1)
VCAP2: C49.2 U8.F13(VCAP2)
VCP_RX: U8.G15(PC7) ; port VCP_RX
VCP_TX: U8.H15(PC6) ; port VCP_TX
WIFI_CH_PD: U8.D11(PD3) ; port WIFI_CH_PD
WIFI_GPIO_0: U8.A8(PG13) ; port WIFI_GPIO_0
WIFI_GPIO_2: U8.B11(PD6) ; port WIFI_GPIO_2
WIFI_RST: U8.A7(PG14) ; port WIFI_RST
WIFI_RX: U8.A12(PC12) ; port WIFI_RX
WIFI_TX: U8.D12(PD2) ; port WIFI_TX
NetC48_2: C48.2 R49.1 X2.1
NetC51_2: C51.2 R50.1 X2.2
NetR55_2: R55.2 X3.1(EN)

### Buses and harness runs
bus ARD_A[0..5] = port ARD_A[0..5]
bus ARD_D[0..15] = port ARD_D[0..15]
bus LCD_PSRAM_D[0..15] = port LCD_PSRAM_D[0..15]
bus PSRAM_A[0..17] = port PSRAM_A[0..17]

### Notes on the sheet
- (*)
  ARD A1 conflict with STMOD+ ADC DAC (PA4)
  ARD D5 conflict with STMOD+ PWM (PB0)
  ARD D14 shared with STMOD+ I2C2 SDA (PH5)
  ARD D15 shared with STMOD+ I2C2 SCL (PH4)
- (near U8) PA0
- (near U8) PA1
- (near U8) PA2
- (near U8) PA3
- (near U8) PA4
- PC0
- PC1
- PC2
- PC3
- PC4
- (near U8) PD0
- (near U8) PG0
- PMOD_SEL_0/1 => SPI2 or UART7 to PMOD#1-4
- (near U8) PA5
- (near U8) PA6
- (near U8) PA7
- (near U8) PA8
- (near U8) PA9
- PC5
- PC6
- PC7
- PC8
- PC9
- (near U8) PD1
- (near U8) PD2
- (near U8) PD3
- (near U8) PD4
- (near U8) PD5
- (near U8) PG1
- (near U8) PG2
- (near U8) PG3
- (near U8) PG4
- (near U8) PG5
- (near U8) PA10
- (near U8) PA11
- (near U8) PA12
- (near U8) PA13
- (near U8) PA14
- PC10
- PC11
- PC12
- PC13
- (near U8) PD6
- (near U8) PD7
- (near U8) PD8
- (near U8) PD9
- (near U8) PD10
- (near U8) PG8
- (near U8) PG9
- (near U8) PG10
- (near U8) PA15
- (near U8) PB0
- (near U8) PB1
- (near U8) PB2
- (near U8) PD11
- (near U8) PD12
- (near U8) PD13
- (near U8) PD14
- (near U8) PD15
- (near U8) PG11
- (near U8) PG12
- (near U8) PG13
- (near U8) PG14
- (near U8) PG15
- (near U8) PB3
- (near U8) PB4
- (near U8) PB5
- (near U8) PB6
- (near U8) PB7
- (near U8) PE0
- (near U8) PE1
- (near U8) PE2
- (near U8) PE3
- (near U8) PH2
- (near U8) PH3
- (near U8) PB8
- (near U8) PB9
- (near U8) PB10
- (near U8) PB11
- (near U8) PB12
- (near U8) PE4
- (near U8) PE5
- (near U8) PE6
- (near U8) PE7
- (near U8) PE8
- (near U8) PH4
- (near U8) PH5
- (near U8) PH6
- (near U8) PH7
- (near U8) PH8
- (near U8) PB13
- (near U8) PB14
- (near U8) PB15
- (near U8) PC14
- (near U8) PE9
- (near U8) PE10
- (near U8) PE11
- (near U8) PE12
- (near U8) PE13
- (near U8) PH9
- (near U8) PH10
- (near U8) PH11
- (near U8) PH12
- (near U8) PH13
- PC15
- PH0
- PH1
- (near U8) PE14
- (near U8) PE15
- (near U8) PF0
- (near U8) PF1
- (near U8) PH14
- (near U8) PH15
- (near U8) PI0
- (near U8) PI1
- NRST
- BOOT0
- (near R45) PDR_ON
- (near U8) PF2
- (near U8) PF3
- (near U8) PF4
- (near U8) PF5
- (near U8) PF6
- (near U8) PI2
- (near U8) PI3
- (near U8) PI4
- (near U8) PI5
- (near U8) PI6
- (near C93) Place near MCU
- (near U8) PF7
- (near U8) PF8
- (near U8) PF9
- (near U8) PF10
- (near U8) PF11
- (near U8) PI7
- (near U8) PI8
- (near U8) PI9
- (near U8) PI10
- (near U8) PI11
- (near U8) PF12
- (near U8) PF13
- (near U8) PF14
- (near U8) PF15
- (near U8) PMOD_SEL_0
- PMOD_SEL_1
- PMOD#1
- 0
- NSS
- SPI
- UART/SPI
- 0 (*)
- 1 (*)
- CTS
- UART
- 1
- (*) default configuration to support MikroBus modules using MB1280 fan-out board
- PMOD#2
- PMOD#3
- PMOD#4
- MOSIp
- MISOp
- SCK
- TX
- RX
- RTS
- Ceramic capacitor (Low ESR)
- Title:
- Project:
- Size:
- Revision:
- Variant:
- A3
- -
- Date:
- Reference:
- Sheet:
- of

### Library data of the parts
C34 C66 = Cap_4.7uF_POL_10%_TANA: Polarized Capacitor,4.7uF,16V,10%,typeA,AVX; Manuf_Part_1: TAJA475K016R; Ordered by: Subcon; Fitted: YES; Revision: July-2002: Re-released for DXP Platform.; Value: 4.7uF; Manuf_1: AVX; Order: TAJA475K016R; ECCN_US/EU: n/a
C36-C40 C44-C47 C52 C53 C55 C56 C59-C62 C93 = Cap_100nF_X7R_10%_0402: Capacitor,100nF,16V,X7R,10%,0402,YAGEO; Manuf_Part_1: CC0402KRX7R7BB104; Ordered by: Subcon; Fitted: YES; Revision: July-2002: Re-released for DXP Platform.; Value: 100nF; Order: CC0402KRX7R7BB104; Manuf_1: YAGEO; ECCN_US/EU: n/a
C48 C51 = Cap_4.7pF_NPO_-+0.25pF_0402: Capacitor, 4.7pF, 50V, NPO, -+0.25pF, 0402, YAGEO; Manuf_Part_1: CC0402CRNPO9BN4R7; Order: 311-1633-2-ND; Ordered by: Subcon; Fitted: YES; Revision: July-2002: Re-released for DXP Platform.; Manuf_1: YAGEO; ECCN_US/EU: n/a; Distrib: DIGIKEY
C49 C58 = Cap_2.2uF_X7R_10%_1206: Capacitor,2.2uF,16V, X7R,10%,1206,YAGEO; Manuf_Part_1: CC1206KKX7R7BB225; Manuf_Part_2: C1206C225K4RAC; Manuf_2: KEMET; Ordered by: Subcon; Fitted: YES; Revision: July-2002: Re-released for DXP Platform.; Value: 2.2uF; Order: CC1206KKX7R7BB225; Manuf_1: YAGEO; ECCN_US/EU: n/a
C54 = Cap_2.2uF_X5R_10%_0603: Capacitor,2.2uF,10V, X5R,10%,0603,YAGEO; Manuf_Part_1: CC0603KRX5R6BB225; Manuf_Part_2: C0603C225K8PACTU; Manuf_2: KEMET; Ordered by: Subcon; Fitted: YES; Revision: July-2002: Re-released for DXP Platform.; Order: *; Manuf_1: YAGEO; ECCN_US/EU: n/a
C64 C65 = Cap_1uF_POL_10%_TANA: Polarized Capacitor,1uF,16V,10%,typeA,AVX; Manuf_Part_1: TAJA105K016R; Ordered by: Subcon; Fitted: YES; Revision: July-2002: Re-released for DXP Platform.; Value: 1uF; Manuf_1: AVX; Distrib: *; Order: TAJA105K016R; ECCN_US/EU: n/a
JP1 = JP2: Fitted: NO; Ordered by: Subcon; ECCN_US/EU: n/a
L1 = BEAD_600R_350MA_0603: Bead,600R,350mA,0603,FCM1608KF-601T03,Tai-tech; Manuf_2: TDK; Manuf_Part_2: MPZ1608S300A; Manuf_Part_3: BLM18PG121SN1D; Manuf_3: MURATA; Value: 100uH; Description_2: Bead,30R,5A,0603,MPZ1608S300A,TDK; Description_3: Bead,120R,2A,0603,BLM18PG121SN1D,MURATA; Ordered by: Subcon; Fitted: YES; Revision: July-2002: Re-released for DXP Platform.; Manuf_Part_1: FCM1608KF-601T03; Manuf_1: Tai-tech; ECCN_US/EU: n/a
R27 R62 = Res_0_5%_0603: as R72 on sheet USB_OTG_FS; ECCN_US/EU: n/a; Manuf_1: YAGEO; Distrib: FARNELL
R36 R45 R55 R61 = Res_10K_1%_0402: as R76 on sheet USB_OTG_FS; Value: 10K; Manuf_1: YAGEO; Order: RC0402FR-0710KL; ECCN_US/EU: n/a
R37 R43 R57 = Res_10K_1%_0402: Resistor,10K,0402,1%,YAGEO; Manuf_Part_1: RC0402FR-0710KL; Ordered by: Subcon; Value: 10K; Manuf_1: YAGEO; Order: RC0402FR-0710KL; ECCN_US/EU: n/a
R42 R44 R52 R56 R59 R60 = Res_2K7_1%_0402: Resistor,2K7,0402,1%,YAGEO; Manuf_Part_1: RC0402FR-072K7L; Ordered by: Subcon; Fitted: YES; Value: 2K7; Manuf_1: YAGEO; Order: RC0402FR-072K7L; ECCN_US/EU: n/a; Distrib: FARNELL
R49 R50 R101 = Res_0_5%_0402: Resistor,0,0402,5%,YAGEO; Manuf_Part_1: RC0402JR-070RL; Order: 2363467; Ordered by: Subcon; Fitted: YES; Value: 0; ECCN_US/EU: n/a; Manuf_1: YAGEO; Distrib: FARNELL
R51 = Res_100_1%_0402: Resistor,100,0402,1%,YAGEO; Manuf_Part_1: RC0402FR-07100RL; Order: 9239111; Ordered by: Subcon; Fitted: YES; Value: 100; Manuf_1: YAGEO; ECCN_US/EU: n/a; Distrib: FARNELL
R54 = Res_3K_1%_0402: Resistor 3K 0402 1% YAGEO; Manuf_Part_1: RC0402FR-073KL; Ordered by: Subcon; Fitted: YES; Value: 3K; Manuf_1: YAGEO; Order: RC0402FR-073KL; ECCN_US/EU: n/a
TP3-TP8 TP11-TP15 = TP: Test Point; Fitted: NO; Ordered by: Subcon; ECCN_US/EU: n/a
U8 = STM32F723IEK: STM32F723IEK  (STM32F7 LittleBirdie) BGA176; Manuf_1: STM; Fitted: YES; Ordered by: ST; Manuf_Part_1: STM32F723IEK
X2 = XTAL_32K_NX3215SA: Crystal 32.768kHz, 6pF, -+20PPM, R=50K, SMD; Manuf_1: NDK; Manuf_Part_1: NX3215SA 32.768KHz EXS00A-MU00525; ECCN_US/EU: EAR99/NEC; Ref St: 9157034; NDK Ref: X3101802; Provided: ST; Fitted: YES; Distrib: *; Order: NX3215SA 32.768KHz EXS00A-MU00525; Ordered by: ST
X3 = OSC_25M_NZ2520SB: Oscillator 25.00Mhz, -+50PPM, 3.3V, Temp -55 to +125°C; Manuf_Part_1: NZ2520SB 25MHz END4869B; Manuf_1: NDK; Manuf_Part_2: KC2520B25.0000C10E00; Manuf_2: AVX Corp/Kyocera Corp; ECCN_US/EU: EAR99/NEC; Ref St: 9157031; Provided: ST; Fitted: YES; Order: *; Ordered by: ST

## Sheet LCD_FRIDA.SchDoc: LCD_Frida
size A3; Author: N.P; CompanyName: STMicroelectronics; Organization: MCD/APPLICATIONS/LMS; DocumentNumber: 10; Revision: D-01; SheetNumber: 10; SheetTotal: 13; Project: STM32F723e-DISCO; PageSetup: Record=PageOptions|CenterHorizontal=True|CenterVertical=True|PrintScale=1.00|XCorrection=1.00|YCorrection=1.00|PrintKind=1|BorderSize=5000000|LeftOffset=0|BottomOffset=0|Orientation=2|PaperLength=1000|PaperWidth=1000|Scale=100|PaperSource=7|PrintQuality=-3|MediaType=1|DitherType=10|PrintScaleMode=1|PaperKind=Letter|PaperIndex=1; BOM Version: D-01
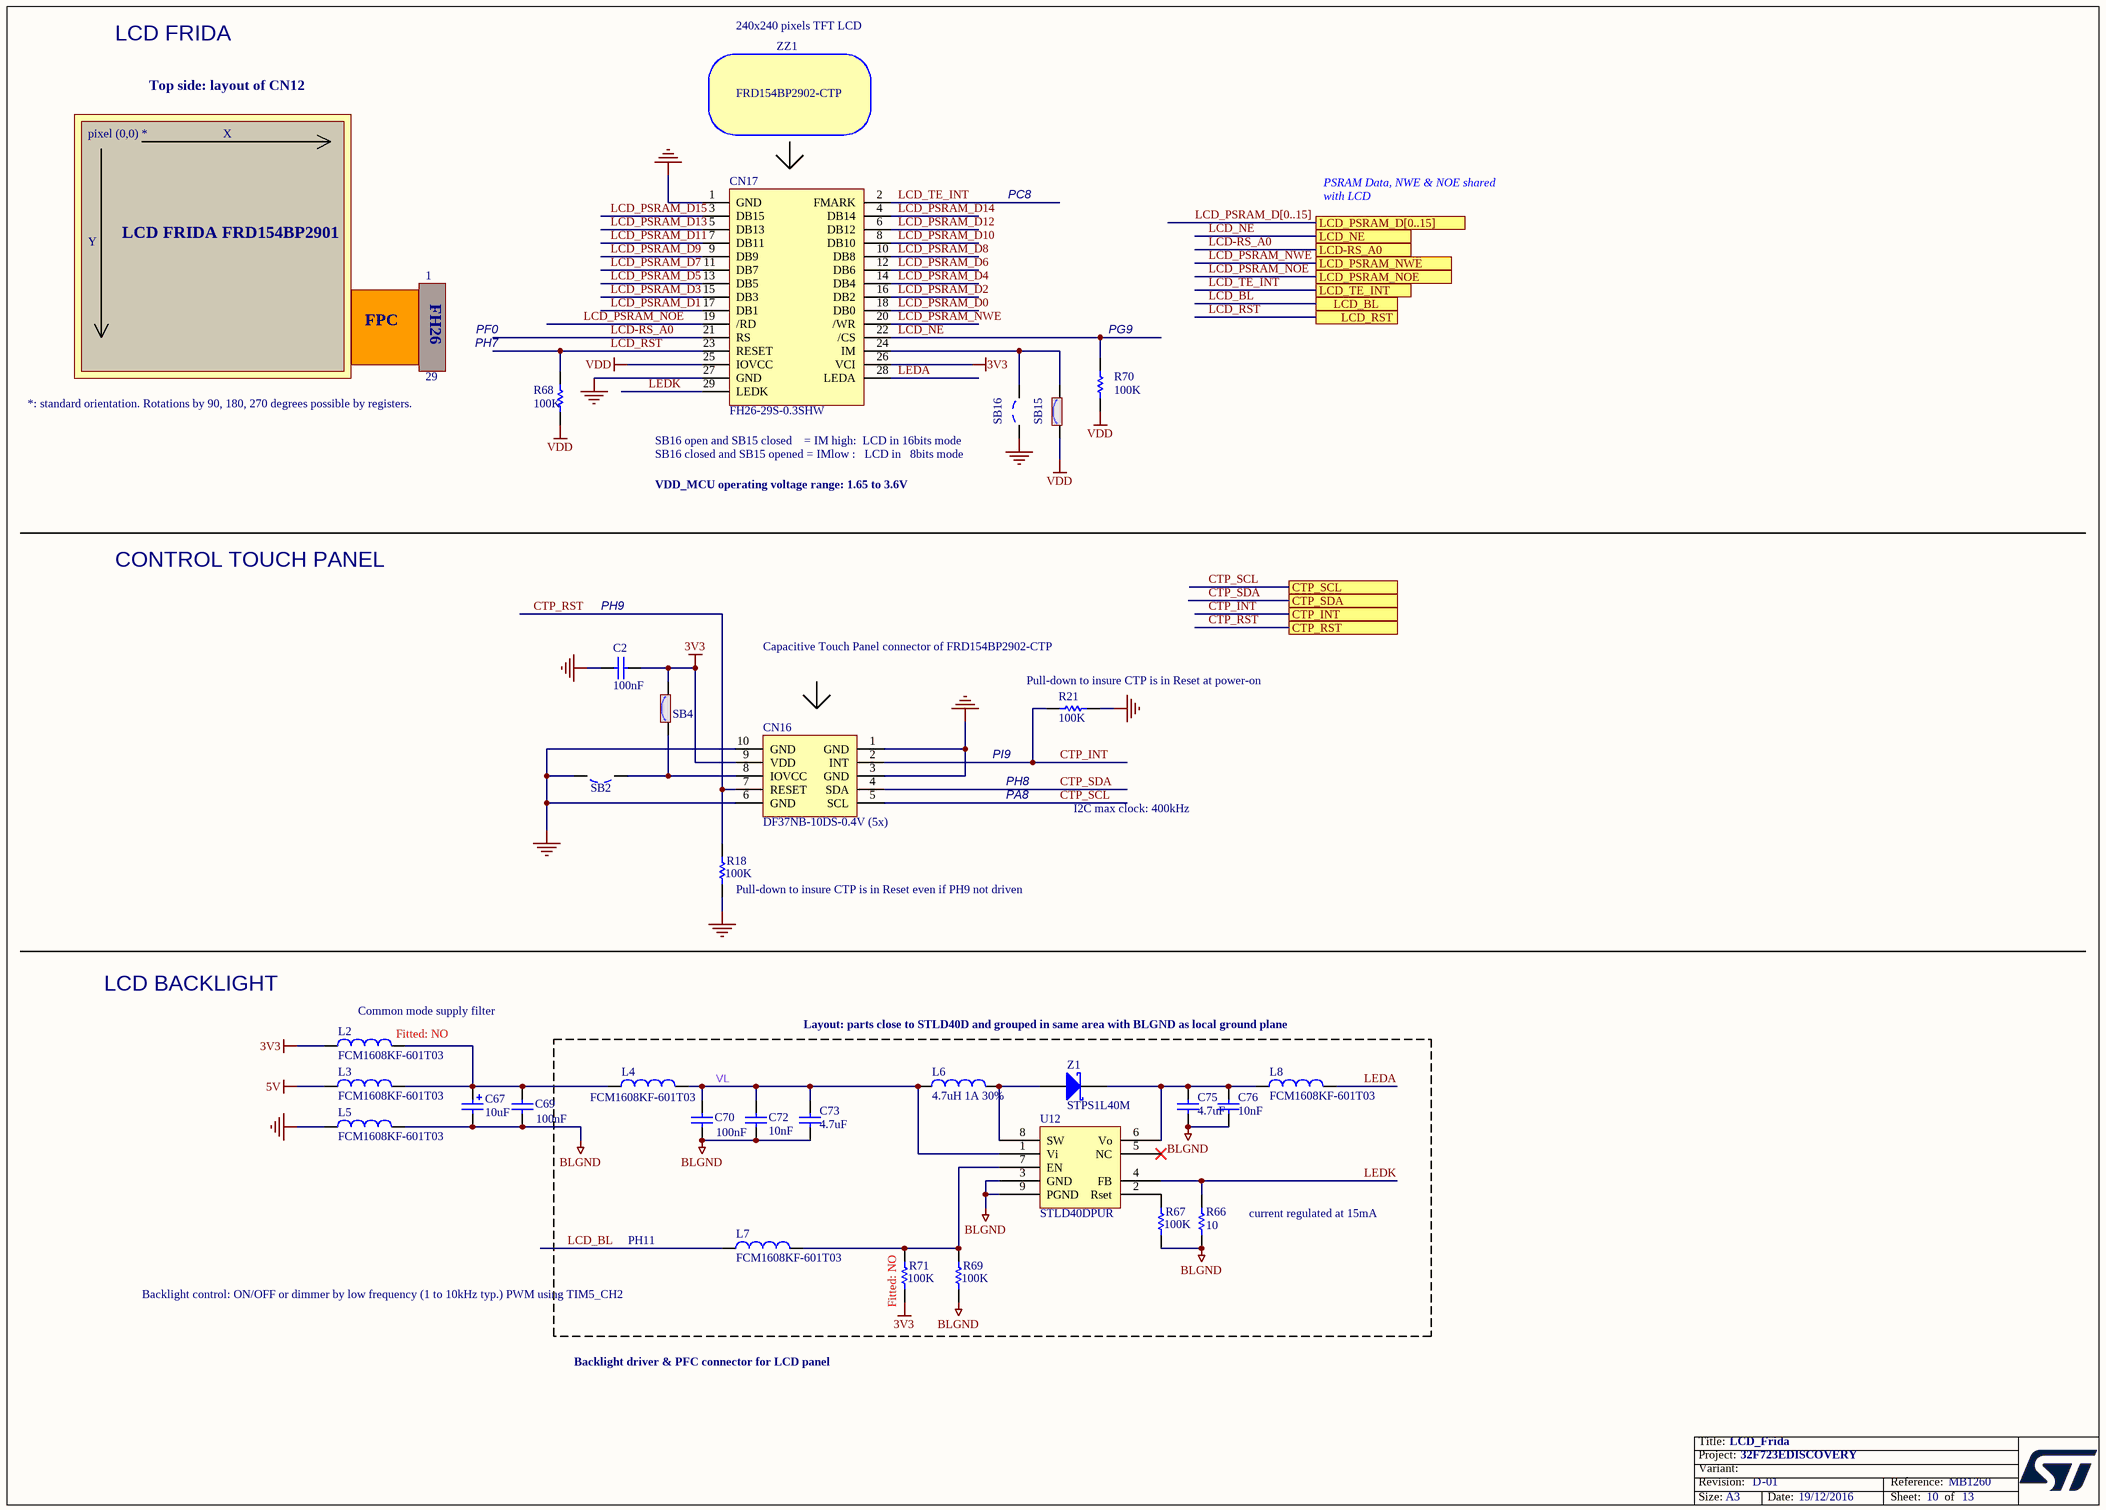
[diagram p9: LCD_FRIDA.SchDoc]

### Parts
C2  100nF  [0402C]
C67  value 10uF  [TAN-A]  (hidden comment: 10uF_POL_10%_TANA)
C69  100nF  [0402C]
C70  100nF  [0402C]
C72  value 10nF  [0603C]  (hidden comment: 10nF_X7R_10%_0603)
C73  value 4.7uF  [1206C]  (hidden comment: 4.7uF_X7R_10%_1206)
C75  value 4.7uF  [1206C]  (hidden comment: 4.7uF_X7R_10%_1206)
C76  value 10nF  [0603C]  (hidden comment: 10nF_X7R_10%_0603)
CN16  DF37NB-10DS-0.4V (5x)  [DF37NB-10DS-0R4V]
CN17  FH26-29S-0.3SHW  [FH26-29S-0R3SHW]
L2  FCM1608KF-601T03  Fitted: NO  [0603L]
L3  FCM1608KF-601T03  [0603L]
L4  FCM1608KF-601T03  [0603L]
L5  FCM1608KF-601T03  [0603L]
L6  4.7uH 1A 30%  [1210L]
L7  FCM1608KF-601T03  [0603L]
L8  FCM1608KF-601T03  [0603L]
R18  value 100K  [0402R]  (hidden comment: 100K_1%_0402)
R21  value 100K  [0402R]  (hidden comment: 100K_1%_0402)
R66  value 10  [0603R]  (hidden comment: 10_1%_0603)
R67  value 100K  [0402R]  (hidden comment: 100K_1%_0402)
R68  value 100K  [0402R]  (hidden comment: 100K_1%_0402)
R69  value 100K  [0402R]  (hidden comment: 100K_1%_0402)
R70  value 100K  [0402R]  (hidden comment: 100K_1%_0402)
R71  value 100K  Fitted: NO  [0402R]  (hidden comment: 100K_1%_0402)
SB2  Solder Bridge OFF  [JP2_SMD]  (value not drawn)
SB4  Solder Bridge ON  [JP2_SMD]  (value not drawn)
SB15  Solder Bridge ON  [JP2_SMD]  (value not drawn)
SB16  Solder Bridge OFF  [JP2_SMD]  (value not drawn)
U12  STLD40DPUR  [SON8_0R65_3X3]
Z1  STPS1L40M  [DO-216AA]
ZZ1  FRD154BP2902-CTP

### Ports
CTP_INT, CTP_RST, CTP_SCL, CTP_SDA, LCD-RS_A0, LCD_BL, LCD_NE, LCD_PSRAM_D[0..15], LCD_PSRAM_NOE, LCD_PSRAM_NWE, LCD_RST, LCD_TE_INT

### Nets
3V3: C2.1 CN16.9(VDD) CN17.26(VCI) L2.1 R71.1 SB4.2
5V: L3.1
BLGND: C67.2 C69.1 C70.1 C72.1 C73.1 C75.1 C76.1 L5.2 R66.1 R67.1 R69.1 U12.3(GND) U12.9(PGND)
GND: C2.2 CN16.1(GND) CN16.3(GND) CN16.6(GND) CN16.10(GND) CN17.1(GND) CN17.27(GND) L5.1 R18.1 R21.1 SB2.2 SB16.1
VDD: CN17.25(IOVCC) R68.1 R70.1 SB15.1
CTP_INT: CN16.2(INT) R21.2 ; port CTP_INT
CTP_RST: CN16.7(RESET) R18.2 ; port CTP_RST
CTP_SCL: CN16.5(SCL) ; port CTP_SCL
CTP_SDA: CN16.4(SDA) ; port CTP_SDA
LCD-RS_A0: CN17.21(RS) ; port LCD-RS_A0
LCD_BL: L7.1 ; port LCD_BL
LCD_NE: CN17.22(/CS) R70.2 ; port LCD_NE
LCD_PSRAM_D0: CN17.18(DB0)
LCD_PSRAM_D1: CN17.17(DB1)
LCD_PSRAM_D2: CN17.16(DB2)
LCD_PSRAM_D3: CN17.15(DB3)
LCD_PSRAM_D4: CN17.14(DB4)
LCD_PSRAM_D5: CN17.13(DB5)
LCD_PSRAM_D6: CN17.12(DB6)
LCD_PSRAM_D7: CN17.11(DB7)
LCD_PSRAM_D8: CN17.10(DB8)
LCD_PSRAM_D9: CN17.9(DB9)
LCD_PSRAM_D10: CN17.8(DB10)
LCD_PSRAM_D11: CN17.7(DB11)
LCD_PSRAM_D12: CN17.6(DB12)
LCD_PSRAM_D13: CN17.5(DB13)
LCD_PSRAM_D14: CN17.4(DB14)
LCD_PSRAM_D15: CN17.3(DB15)
LCD_PSRAM_NOE: CN17.19(/RD) ; port LCD_PSRAM_NOE
LCD_PSRAM_NWE: CN17.20(/WR) ; port LCD_PSRAM_NWE
LCD_RST: CN17.23(RESET) R68.2 ; port LCD_RST
LCD_TE_INT: CN17.2(FMARK) ; port LCD_TE_INT
LEDA: CN17.28(LEDA) L8.2
LEDK: CN17.29(LEDK) R66.2 U12.4(FB)
VL: C70.2 C72.2 C73.2 L4.2 L6.1 U12.1(Vi)
NetC67_1: C67.1 C69.2 L2.2 L3.2 L4.1
NetC75_2: C75.2 C76.2 L8.1 U12.6(Vo) Z1.2(K)
NetCN16_8: CN16.8(IOVCC) SB2.1 SB4.1
NetCN17_24: CN17.24(IM) SB15.2 SB16.2
NetL6_2: L6.2 U12.8(SW) Z1.1(A)
NetL7_2: L7.2 R69.2 R71.2 U12.7(EN)
NetR67_2: R67.2 U12.2(Rset)

Not connected (* = marked no-connect by the designer): U12 5(NC)*

### Buses and harness runs
bus LCD_PSRAM_D[0..15] = port LCD_PSRAM_D[0..15]

### Notes on the sheet
- LCD FRIDA
- 240x240 pixels TFT LCD
- Top side: layout of CN12
- pixel (0,0) *
- X
- Y
- LCD FRIDA FRD154BP2901
- PC8
- PSRAM Data, NWE & NOE shared with LCD
- 1
- FH26
- FPC
- 29
- PF0
- PH7
- (near R70) PG9
- (near R68) *: standard orientation. Rotations by 90, 180, 270 degrees possible by registers.
- SB16 open and SB15 closed    = IM high:  LCD in 16bits mode
  SB16 closed and SB15 opened = IMlow :   LCD in   8bits mode
- VDD_MCU operating voltage range: 1.65 to 3.6V
- CONTROL TOUCH PANEL
- PH9
- Capacitive Touch Panel connector of FRD154BP2902-CTP
- (near R21) Pull-down to insure CTP is in Reset at power-on
- PI9
- PH8
- PA8
- I2C max clock: 400kHz
- (near R18) Pull-down to insure CTP is in Reset even if PH9 not driven
- LCD BACKLIGHT
- (near L2) Common mode supply filter
- Layout: parts close to STLD40D and grouped in same area with BLGND as local ground plane
- PH11
- (near R66) current regulated at 15mA
- Backlight control: ON/OFF or dimmer by low frequency (1 to 10kHz typ.) PWM using TIM5_CH2
- Backlight driver & PFC connector for LCD panel
- Title:
- Project:
- Size:
- Revision:
- Variant:
- A3
- -
- Date:
- Reference:
- Sheet:
- of

### Library data of the parts
C2 C69 C70 = Cap_100nF_X7R_10%_0402: as C36-C40 on sheet STM32F7; Revision: July-2002: Re-released for DXP Platform.; Value: 100nF; Order: CC0402KRX7R7BB104; Manuf_1: YAGEO; ECCN_US/EU: n/a
C67 = Cap_10uF_POL_10%_TANA: Polarized Capacitor,10uF,10V,10%,typeA,VISHAY; Manuf_Part_1: 293D106X9010A2TE3; Ordered by: Subcon; Fitted: YES; Revision: July-2002: Re-released for DXP Platform.; Manuf_1: VISHAY; Order: *; ECCN_US/EU: n/a
C72 C76 = Cap_10nF_X7R_10%_0603: Capacitor,10nF,50V,X7R,10%,0603,YAGEO; Manuf_Part_1: CC0603KRX7R9BB103; Ordered by: Subcon; Fitted: YES; Revision: July-2002: Re-released for DXP Platform.; Order: CC0603KRX7R9BB103; Manuf_1: YAGEO; ECCN_US/EU: n/a
C73 C75 = Cap_4.7uF_X7R_10%_1206: Capacitor,4.7uF,50V, X7R,10%,1206,AVX; Manuf_Part_1: 12065C475KAT2A; Ordered by: Subcon; Fitted: YES; Revision: July-2002: Re-released for DXP Platform.; Order: *; Manuf_1: AVX; ECCN_US/EU: n/a; Distrib: FARNELL
CN16 = Header 5X2A: Header, 5-Pin, Dual row; Manuf_1: Hirose; Ordered by: Subcon; Fitted: YES; LatestRevisionDate: 17-Jul-2002; LatestRevisionNote: Re-released for DXP Platform.; Publisher: Altium Limited; Manuf_Part_1: DF37NB-10DS-0.4V (5x); ECCN_US/EU: n/a
CN17 = FH26-29S-0.3SHW: 29pins FPC connector; Manuf_1: Hirose; Ordered by: Subcon; Fitted: YES; Manuf_Part_1: FH26-29S-0.3SHW; ECCN_US/EU: n/a
L2 = BEAD_600R_350MA_0603: Bead,600R,350mA,0603,FCM1608KF-601T03,Tai-tech; Manuf_2: TDK; Manuf_Part_2: MPZ1608S300A; Manuf_Part_3: BLM18PG121SN1D; Manuf_3: MURATA; Value: 100uH; Description_2: Bead,30R,5A,0603,MPZ1608S300A,TDK; Description_3: Bead,120R,2A,0603,BLM18PG121SN1D,MURATA; Fitted: NO; Ordered by: Subcon; Revision: July-2002: Re-released for DXP Platform.; Manuf_Part_1: FCM1608KF-601T03; Manuf_1: Tai-tech; ECCN_US/EU: n/a
L3-L5 L7 L8 = BEAD_600R_350MA_0603: as L1 on sheet STM32F7; Revision: July-2002: Re-released for DXP Platform.; Manuf_Part_1: FCM1608KF-601T03; Manuf_1: Tai-tech; ECCN_US/EU: n/a
L6 = Ind_4.7uH_1A_30%: FIXED IND 4.7UH 1A 180 MOHM 30% SMD; Manuf_Part_1: LQH32PN4R7NN0L; Manuf_1: MURATA; Order: 490-5338-1-ND; Ordered by: Subcon; Fitted: YES; Distrib: DIGIKEY; ECCN_US/EU: n/a
R18 R21 R67-R70 = Res_100K_1%_0402: Resistor,100K,0402,1%,YAGEO; Manuf_Part_2: RT0402FRE07100KL; Manuf_Part_1: RC0402FR-07100KL; Ordered by: Subcon; Fitted: YES; Manuf_1: YAGEO; ECCN_US/EU: n/a; Manuf_2: YAGEO
R66 = Res_10_1%_0603: Resistor,10,0603,1%,ROHM,1/4W; Manuf_Part_1: ESR03EZPF10R0; Ordered by: Subcon; Fitted: YES; Manuf_1: ROHM; Order: *; ECCN_US/EU: n/a
R71 = Res_100K_1%_0402: Resistor,100K,0402,1%,YAGEO; Manuf_Part_2: RT0402FRE07100KL; Manuf_Part_1: RC0402FR-07100KL; Ordered by: Subcon; Manuf_1: YAGEO; ECCN_US/EU: n/a; Manuf_2: YAGEO
SB2 SB16 = SB_OFF: Fitted: NO; Ordered by: Subcon; Revision: July-2002: Re-released for DXP Platform.; ECCN_US/EU: n/a
SB4 SB15 = SB_ON: Fitted: YES; Ordered by: Subcon; Revision: July-2002: Re-released for DXP Platform.; ECCN_US/EU: n/a
U12 = STLD40DPMR: White LED power supply for large display backlight; Manuf_1: STM; Ordered by: ST; Ref St: 9176009; ECCN_US/EU: EAR99/NEC; Fitted: YES; Manuf_Part_1: STLD40DPUR; Provided: ST; Distrib: ST
Z1 = D Schottky: Schottky Diode; Manuf_1: STM; Code - JEDEC: DO-214-AA; Ordered by: ST; Ref St: 9151085; ECCN_US/EU: EAR99/NEC; Fitted: YES; Published: 8-Jun-2000; Revision: July-2002: Re-released for DXP Platform.; Publisher: Altium Limited; Manuf_Part_1: STPS1L40M; Distrib: ST; Provided: ST
ZZ1 = BoM_Item: Frida LCD + Capacitive Touch Panel; Ordered by: Subcon; ECCN_US/EU: EAR99/NEC; Fitted: YES; Manuf_1: FRIDA; Manuf_Part_1: FRD154BP2902-CTP

## Sheet USB_OTG_HS.SchDoc: USB OTG HS PHY with micro A-B connector
size A4; Author: N.P; CompanyName: STMicroelectronics; Organization: MCD/APPLIS/LMS; DocumentNumber: 8; Revision: D-01; SheetNumber: 8; SheetTotal: 13; Project: STM32F723e-DISCO; BOM Version: D-01
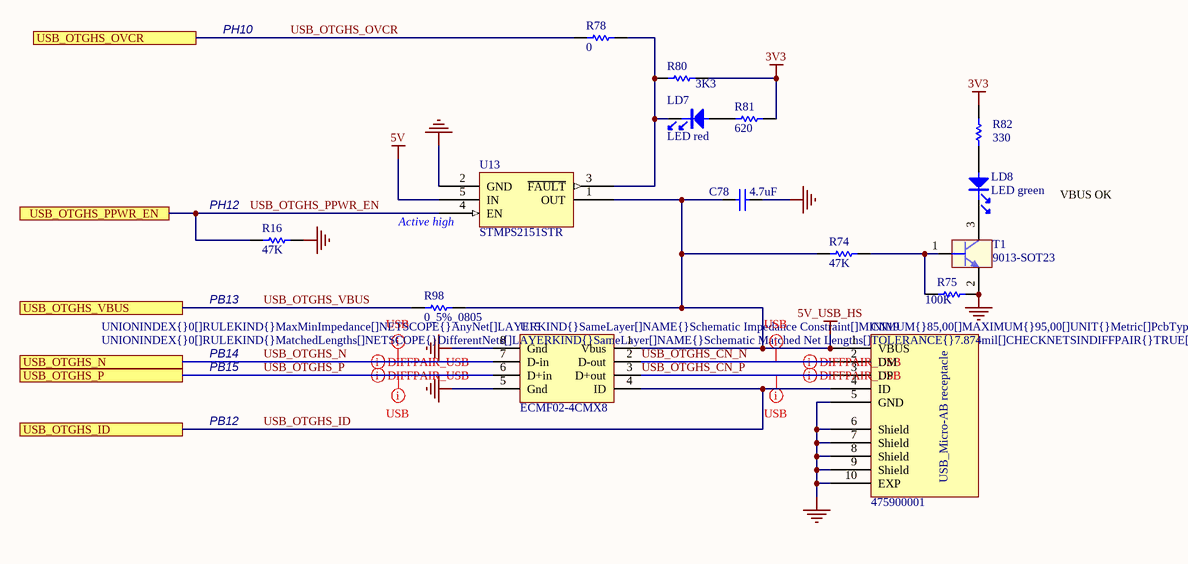
[diagram p10: USB_OTG_HS.SchDoc]

### Parts
C78  4.7uF  [0603C]
CN19  475900001  [MOLEX_47590001]
LD7  LED red  [0603D]
LD8  LED green  [0603D]
R16  value 47K  [0402R]  (hidden comment: 47K_1%_0402)
R74  value 47K  [0402R]  (hidden comment: 47K_1%_0402)
R75  value 100K  [0402R]  (hidden comment: 100K_1%_0402)
R78  0  [0402R]
R80  3K3  [0402R]
R81  value 620  [0603R]  (hidden comment: 620_1%_0603)
R82  value 330  [0603R]  (hidden comment: 330_1%_0603)
R98  0_5%_0805  [0805R]
T1  9013-SOT23  [SOT-23]
U13  STMPS2151STR  [SOT23-5]
U15  ECMF02-4CMX8  [QFN8_0R5_2R5X1R2]

### Ports
USB_OTGHS_ID, USB_OTGHS_N, USB_OTGHS_OVCR, USB_OTGHS_P, USB_OTGHS_PPWR_EN, USB_OTGHS_VBUS

### Nets
3V3: R80.1 R81.1 R82.2
5V: U13.5(IN)
5V_USB_HS: C78.1 CN19.1(VBUS) R74.2 R98.2 U13.1(OUT) U15.1(Vbus)
GND: C78.2 CN19.5(GND) CN19.6(Shield) CN19.7(Shield) CN19.8(Shield) CN19.9(Shield) CN19.10(EXP) R16.1 R75.2 T1.2(E) U13.2(GND) U15.5(Gnd) U15.8(Gnd)
USB_OTGHS_CN_N: CN19.2(DM) U15.2(D-out)
USB_OTGHS_CN_P: CN19.3(DP) U15.3(D+out)
USB_OTGHS_ID: CN19.4(ID) U15.4(ID) ; port USB_OTGHS_ID
USB_OTGHS_N: U15.7(D-in) ; port USB_OTGHS_N
USB_OTGHS_OVCR: R78.2 ; port USB_OTGHS_OVCR
USB_OTGHS_P: U15.6(D+in) ; port USB_OTGHS_P
USB_OTGHS_PPWR_EN: R16.2 U13.4(EN) ; port USB_OTGHS_PPWR_EN
USB_OTGHS_VBUS: R98.1 ; port USB_OTGHS_VBUS
NetLD7_1: LD7.1 R81.2
NetLD7_2: LD7.2 R78.1 R80.2 U13.3(~{FAULT})
NetLD8_1: LD8.1 R82.1
NetLD8_2: LD8.2 T1.3(C)
NetR74_1: R74.1 R75.1 T1.1(B)

### Layout directives
differential pair; rule Impedance Constraint [Min = 85.00    Max = 95.00    ]: USB_OTGHS_CN_N, USB_OTGHS_CN_P, USB_OTGHS_N, USB_OTGHS_P
rule Undefined; rule Matched Net Lengths [Tolerance = 0.2mm]; rule Impedance Constraint [Min = 85.00    Max = 95.00    ]: USB_OTGHS_CN_N, USB_OTGHS_CN_P, USB_OTGHS_N, USB_OTGHS_P

### Notes on the sheet
- PH10
- (near R16) PH12
- VBUS OK
- (near U13) Active high
- PB13
- PB14
- PB15
- PB12
- Title:
- Project:
- Size:
- Revision:
- Variant:
- A4
- -
- Date:
- Reference:
- Sheet:
- of
- (in symbol 475900001) USB_Micro-AB receptacle

### Library data of the parts
C78 = Cap_4.7uF_X5R_10%_0603: as C77 on sheet USB_OTG_FS; Revision: July-2002: Re-released for DXP Platform.; Value: 4.7uF; Manuf_1: YAGEO; ECCN_US/EU: n/a
CN19 = 475900001: as CN18 on sheet USB_OTG_FS; Manuf_Part_1: 47590-0001; Manuf_1: MOLEX; ECCN_US/EU: n/a
LD7 = LED_red: as LD10 on sheet USB_OTG_FS; Order: 19-213-R6C-AP1Q2B/3T; ECCN_US/EU: n/a
LD8 = LED_green: as LD9 on sheet USB_OTG_FS; Order: 19-213SYGC/S530-E2/TR8; ECCN_US/EU: n/a
R16 R74 = Res_47K_1%_0402: as R73 on sheet USB_OTG_FS; Manuf_1: YAGEO; ECCN_US/EU: n/a; Distrib: FARNELL
R75 = Res_100K_1%_0402: Resistor,100K,0402,1%,YAGEO; Manuf_Part_1: RC0402FR-07100KL; Manuf_Part_2: RT0402FRE07100KL; Ordered by: Subcon; Fitted: YES; Manuf_1: YAGEO; ECCN_US/EU: n/a; Manuf_2: YAGEO
R78 = Res_0_5%_0402: as R49 on sheet STM32F7; Value: 0; ECCN_US/EU: n/a; Manuf_1: YAGEO; Distrib: FARNELL
R80 = Res_3K3_1%_0402: Resistor,3K3,0402,1%,YAGEO; Manuf_Part_1: RC0402FR-073K3L; Ordered by: Subcon; Fitted: YES; Value: 3K3; Manuf_1: YAGEO; Order: *; ECCN_US/EU: n/a; Distrib: FARNELL
R81 = Res_620_1%_0603: as R84 on sheet USB_OTG_FS; ECCN_US/EU: n/a; Distrib: FARNELL
R82 = Res_330_1%_0603: as R83 on sheet USB_OTG_FS; ECCN_US/EU: n/a; Manuf_1: YAGEO; Distrib: FARNELL; Manuf_2: YAGEO
R98 = Res_0_5%_0805: Resistor,0,0805,5%,YAGEO; Manuf_Part_1: RC0805JR-070RL; Value: 0; Order: 2363489; Fitted: YES; Ordered by: Subcon; ECCN_US/EU: n/a; Manuf_1: YAGEO
T1 = 9013-SOT23: as T2 on sheet USB_OTG_FS; Revision: July-2002: Re-released for DXP Platform.; Distrib: FARNELL; ECCN_US/EU: n/a
U13 = STMPS2151STR: Enhanced single channel power switches; Manuf_1: STM; Provided: ST; ECCN_US/EU: EAR99/NEC; Fitted: YES; Order: STMPS2151STR; Manuf_Part_1: STMPS2151STR; Distrib: ST; Ordered by: ST
U15 = ECMF02-4CMX8: Common mode filter with ESD protection for USB 2.0 interface; Manuf_1: STM; Provided: ST; ECCN_US/EU: EAR99/NEC; Fitted: YES; Order: ECMF02-4CMX8; Manuf_Part_1: ECMF02-4CMX8; Distrib: ST; Ordered by: ST

## Sheet QSPI.SchDoc: Quad SPI Flash Memory (MICRON)
size A4; Author: N.P; CompanyName: STMicroelectronics; Organization: MCD/APPLIS/LMS; DocumentNumber: 7; Revision: D-01; SheetNumber: 7; SheetTotal: 13; Project: STM32F723e-DISCO; BOM Version: D-01
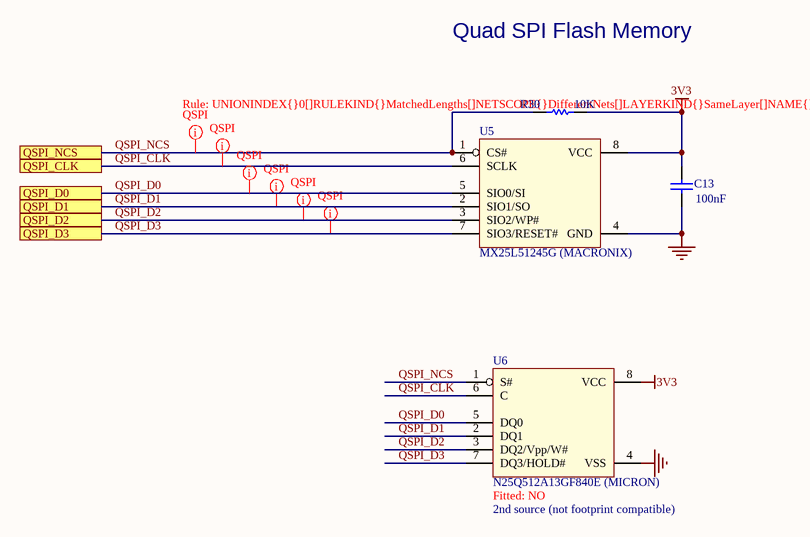
[diagram p11: QSPI.SchDoc]

### Parts
C13  100nF  [0402C]
R30  10K  [0402R]
U5  MX25L51245G (MACRONIX)  [SON8_1R27_6X8]
U6  N25Q512A13GF840E (MICRON)  Fitted: NO  [DFN8_1R27_6X8_TP4R6X5R3]

### Ports
QSPI_CLK, QSPI_D0, QSPI_D1, QSPI_D2, QSPI_D3, QSPI_NCS

### Nets
3V3: C13.2 R30.2 U5.8(VCC) U6.8(VCC)
GND: C13.1 U5.4(GND) U6.4(VSS)
QSPI_CLK: U5.6(SCLK) U6.6(C) ; port QSPI_CLK
QSPI_D0: U5.5(SIO0/SI) U6.5(DQ0) ; port QSPI_D0
QSPI_D1: U5.2(SIO1/SO) U6.2(DQ1) ; port QSPI_D1
QSPI_D2: U5.3(SIO2/WP#) U6.3(DQ2/Vpp/W#) ; port QSPI_D2
QSPI_D3: U5.7(SIO3/RESET#) U6.7(DQ3/HOLD#) ; port QSPI_D3
QSPI_NCS: R30.1 U5.1(CS#) U6.1(S#) ; port QSPI_NCS

### Layout directives
rule Matched Net Lengths [Tolerance = 100mil]: QSPI_CLK, QSPI_D0, QSPI_D1, QSPI_D2, QSPI_D3, QSPI_NCS

### Notes on the sheet
- Quad SPI Flash Memory
- (near U6) 2nd source (not footprint compatible)
- Title:
- Project:
- Size:
- Revision:
- Variant:
- A4
- -
- Date:
- Reference:
- Sheet:
- of

### Library data of the parts
C13 = Cap_100nF_X7R_10%_0402: as C36-C40 on sheet STM32F7; Revision: July-2002: Re-released for DXP Platform.; Value: 100nF; Order: CC0402KRX7R7BB104; Manuf_1: YAGEO; ECCN_US/EU: n/a
R30 = Res_10K_1%_0402: as R76 on sheet USB_OTG_FS; Value: 10K; Manuf_1: YAGEO; Order: RC0402FR-0710KL; ECCN_US/EU: n/a
U5 = MX25L51245G: 512Mb, 3V, Multiple I/O Serial Flash Memory, Quad/Dual; Manuf_Part_1: MX25L51245GZ2I-08G; Manuf_Part_2: MX25L51245GZ2I-10G; Provided: Subcon; Ref St: xxxxxxxxxx; Fitted: YES; ECCN_US/EU: n/a; Manuf_1: MACRONIX; Distrib: MACRONIX; Ordered by: Subcon
U6 = N25Q512A13GF840E: 512Mb, 3V, Multiple I/O Serial Flash Memory, Quad/Dual; ECCN_US/EU: 3A991/NEC; Provided: ST; Ref St: xxxxxxxx; Manuf_1: MICRON; Distrib: MICRON; Manuf_Part_1: N25Q512A13GF840E; Ordered by: ST

## Sheet HW_Mechanical_Parts.SchDoc: HW Mechanical parts
size A4; Date: 19/04/2016; Author: N.P; CompanyName: STMicroelectronics; Organization: MCD/APPLIS/LMS; DocumentNumber: 13; Revision: D-01; SheetNumber: 13; SheetTotal: 13; Project: STM32F723e-DISCO; BOM Version: D-01
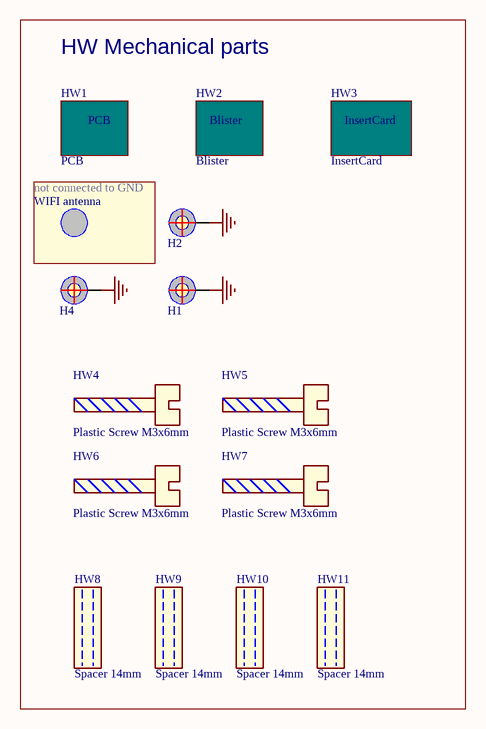
[diagram p12: HW_Mechanical_Parts.SchDoc]

### Parts
H1  POSITION HOLE C6D3R5  [HOLE_C6D3R5]  (value not drawn)  (no BOM)
H2  POSITION HOLE C6D3R5  [HOLE_C6D3R5]  (value not drawn)  (no BOM)
H4  POSITION HOLE C6D3R5  [HOLE_C6D3R5]  (value not drawn)  (no BOM)
HW1  PCB
HW2  Blister
HW3  InsertCard
HW4  Plastic Screw M3x6mm  (mechanical)
HW5  Plastic Screw M3x6mm  (mechanical)
HW6  Plastic Screw M3x6mm  (mechanical)
HW7  Plastic Screw M3x6mm  (mechanical)
HW8  Spacer 14mm  (mechanical)
HW9  Spacer 14mm  (mechanical)
HW10  Spacer 14mm  (mechanical)
HW11  Spacer 14mm  (mechanical)

### Nets
GND: H1.1 H2.1 H4.1

### Notes on the sheet
- HW Mechanical parts
- (near H2) not connected to GND
- WIFI antenna
- Title:
- Project:
- Size:
- Revision:
- Variant:
- A4
- -
- Date:
- Reference:
- Sheet:
- of

### Library data of the parts
H1 H2 H4 = POSITION HOLE C6D3R5: Fitted: NO; Ordered by: Subcon; ECCN_US/EU: n/a
HW1 = PCB: Manuf_Part_1: MB1260 PCB; Manuf_1: Jiubaba; Ordered by: Subcon; Fitted: YES; Revision: 17-Jul-2002: Re-released for DXP Platform.; ECCN_US/EU: n/a
HW2 = Blister: Manuf_Part_1: MB1260 Blister; Manuf_1: Jiubaba; Ordered by: Subcon; Fitted: YES; Revision: 17-Jul-2002: Re-released for DXP Platform.; ECCN_US/EU: n/a
HW3 = InsertCard: Manuf_Part_1: MB1260 InsertCard; Manuf_1: Jiubaba; Ordered by: Subcon; Fitted: YES; Revision: 17-Jul-2002: Re-released for DXP Platform.; ECCN_US/EU: n/a
HW4-HW7 = Plastic Screw M3x6mm: Plastic screw; Ordered_By: Subcon; Fitted: YES; Manuf_1: *; Manuf_Part_1: *; Order_Code: *; Distrib: *; ECCN_US/EU: n/a; Value: Screw M3x6mm; Ordered by: Subcon
HW8-HW11 = Plastic Spacer D4.5x14, M3x0.5: Plastic spacer; Manuf_1: RAF; Manuf_Part_1: M1261-3005-N; Ordered_By: Subcon; Fitted: YES; Order code RS: *; Distrib: *; ECCN_US/EU: n/a; Value: Spacer 14mm; Ordered by: Subcon